# EAGLE design MaTouch ESP32-S3 Parallel TFT with Touch 7“ V1.2 (EAGLE 6.1)
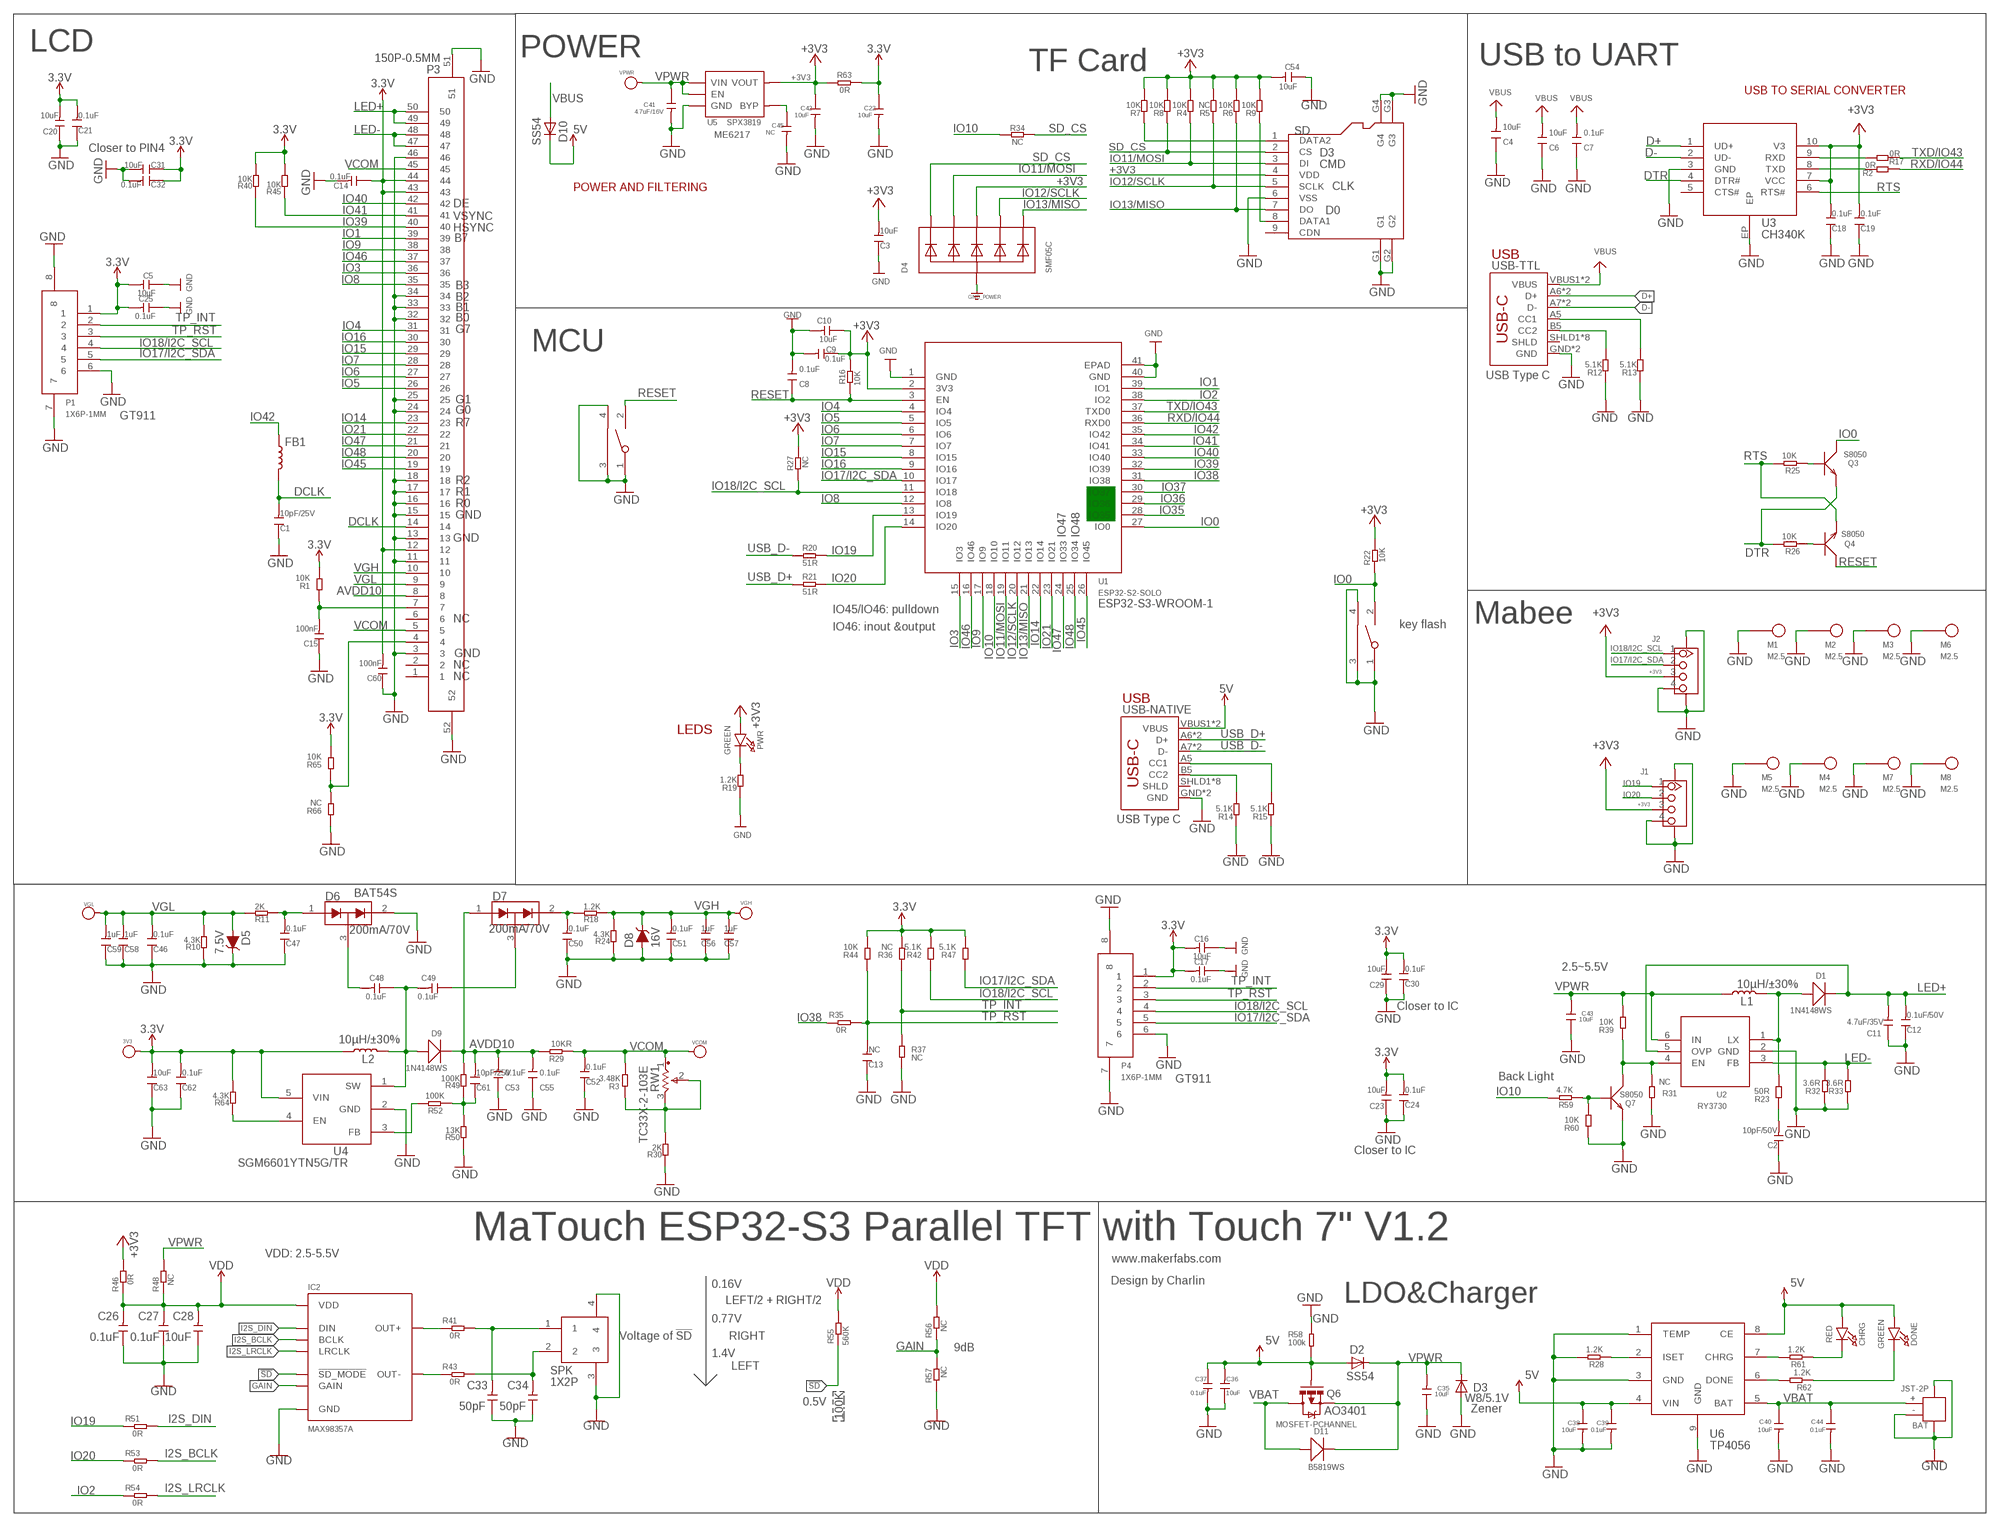
[diagram p0: schematic, sheet 1]

## Parts
3V3  PAD-TEST-POINT-CIRCLE'4545'  [TP_4545]
BAT  JST-2P  JST-2P-SMD'2.0'  [HW2-SMD-2.0-90D]
BOOT  TS24CA  [2*4*3.5MM]
C1  10pF/25V  DISCRETE_C-0603  [DISCRETE_C0603]
C2  10pF/50V  DISCRETE_C-0603  [DISCRETE_C0603]
C3  10uF  DISCRETE_C-0603  [DISCRETE_C0603]
C4  10uF  DISCRETE_C-0603  [DISCRETE_C0603]
C5  10uF  DISCRETE_C-0603  [DISCRETE_C0603]
C6  10uF  DISCRETE_C-0603  [DISCRETE_C0603]
C7  0.1uF  DISCRETE_C-0603  [DISCRETE_C0603]
C8  0.1uF  DISCRETE_C-0603  [DISCRETE_C0603]
C9  0.1uF  DISCRETE_C-0603  [DISCRETE_C0603]
C10  10uF  DISCRETE_C-0603  [DISCRETE_C0603]
C11  4.7uF/35V  DISCRETE_C-1206  [DISCRETE_C1206]
C12  0.1uF/50V  DISCRETE_C-0603  [DISCRETE_C0603]
C13  NC  DISCRETE_C-0603  [DISCRETE_C0603]
C14  0.1uF  DISCRETE_C-0603  [DISCRETE_C0603]
C15  100nF  DISCRETE_C-0603  [DISCRETE_C0603]
C16  10uF  DISCRETE_C-0603  [DISCRETE_C0603]
C17  0.1uF  DISCRETE_C-0603  [DISCRETE_C0603]
C18  0.1uF  DISCRETE_C-0603  [DISCRETE_C0603]
C19  0.1uF  DISCRETE_C-0603  [DISCRETE_C0603]
C20  10uF  DISCRETE_C-0603  [DISCRETE_C0603]
C21  0.1uF  DISCRETE_C-0603  [DISCRETE_C0603]
C22  10uF  C-0603  [0603]
C23  10uF  DISCRETE_C-0603  [DISCRETE_C0603]
C24  0.1uF  DISCRETE_C-0603  [DISCRETE_C0603]
C25  0.1uF  DISCRETE_C-0603  [DISCRETE_C0603]
C26  0.1uF  C-0603  [0603]
C27  0.1uF  C-0603  [0603]
C28  10uF  C-0603  [0603]
C29  10uF  DISCRETE_C-0603  [DISCRETE_C0603]
C30  0.1uF  DISCRETE_C-0603  [DISCRETE_C0603]
C31  10uF  DISCRETE_C-0603  [DISCRETE_C0603]
C32  0.1uF  DISCRETE_C-0603  [DISCRETE_C0603]
C33  50pF  C-0603  [0603]
C34  50pF  C-0603  [0603]
C35  10uF  C-0603  [0603]
C36  10uF  C-0603  [0603]
C37  0.1uF  C-0603  [0603]
C38  10uF  C-0603  [0603]
C39  0.1uF  C-0603  [0603]
C40  10uF  C-0603  [0603]
C41  4.7uF/16V  C-0603  [0603]
C42  10uF  C-0603  [0603]
C43  10uF  C-0603  [0603]
C44  0.1uF  C-0603  [0603]
C45  NC  C-0603  [0603]
C46  0.1uF  DISCRETE_C-0603  [DISCRETE_C0603]
C47  0.1uF  DISCRETE_C-0603  [DISCRETE_C0603]
C48  0.1uF  DISCRETE_C-0603  [DISCRETE_C0603]
C49  0.1uF  DISCRETE_C-0603  [DISCRETE_C0603]
C50  0.1uF  DISCRETE_C-0603  [DISCRETE_C0603]
C51  0.1uF  DISCRETE_C-0603  [DISCRETE_C0603]
C52  0.1uF  DISCRETE_C-0603  [DISCRETE_C0603]
C53  0.1uF  DISCRETE_C-0603  [DISCRETE_C0603]
C54  10uF  DISCRETE_C-0603  [DISCRETE_C0603]
C55  0.1uF  DISCRETE_C-0603  [DISCRETE_C0603]
C56  1uF  DISCRETE_C-0603  [DISCRETE_C0603]
C57  1uF  DISCRETE_C-0603  [DISCRETE_C0603]
C58  1uF  DISCRETE_C-0603  [DISCRETE_C0603]
C59  1uF  DISCRETE_C-0603  [DISCRETE_C0603]
C60  100nF  DISCRETE_C-0603  [DISCRETE_C0603]
C61  10pF/25V  DISCRETE_C-0603  [DISCRETE_C0603]
C62  0.1uF  DISCRETE_C-0603  [DISCRETE_C0603]
C63  10uF  DISCRETE_C-0603  [DISCRETE_C0603]
CHRG  RED  LED0805_NOOUTLINE  [CHIPLED_0805_NOOUTLINE]
D1  1N4148WS  D'0805'  [SOD323]
D2  SS54  DIODE-DO-214AC  [DO-214AC]
D3  W8/5.1V  DIODE-SOD123  [SOD123]
D4  SMF05C  TVSARRAY_5LANE  [SOT363]
D5  7.5V  DIODE-ZENER-MMSZ5232BS  [SOD-323]
D6  200mA/70V  BAV99  [SOT23-3]
D7  200mA/70V  BAV99  [SOT23-3]
D8  16V  DIODE-ZENER-MMSZ5232BS  [SOD-323]
D9  1N4148WS  D'0805'  [SOD323]
D10  SS54  DIODE-DO-214AC  [DO-214AC]
D11  B5819WS  D'0805'  [SOD323]
DONE  GREEN  LED0805_NOOUTLINE  [CHIPLED_0805_NOOUTLINE]
FB1  INDUCTORFB-30OHM  [0603]
IC2  MAX98357A  [TQFN-16]
J1  GROVE-CONNECTOR-SMD'90D'  [HW4-SMD-2.0-90D]
J2  GROVE-CONNECTOR-SMD'90D'  [HW4-SMD-2.0-90D]
L1  10µH/±30%  INDUCTOR-CR54-3.3UH  [CR54]
L2  10µH/±30%  INDUCTOR-CR54-3.3UH  [CR54]
M1  M2.5  [M2.5]
M2  M2.5  [M2.5]
M3  M2.5  [M2.5]
M4  M2.5  [M2.5]
M5  M2.5  [M2.5]
M6  M2.5  [M2.5]
M7  M2.5  [M2.5]
M8  M2.5  [M2.5]
P1  1X6P-1MM  [1*6P-SMT1MM]
P3  150P-0.5MM  [1*50P-SMT0.5MM]
P4  1X6P-1MM  [1*6P-SMT1MM]
PWR  GREEN  LED0805_NOOUTLINE  [CHIPLED_0805_NOOUTLINE]
Q3  S8050  TRANSISTOR-NPN-SOT23  [SOT23]
Q4  S8050  TRANSISTOR-NPN-SOT23  [SOT23]
Q6  MOSFET-PCHANNEL  [SOT23-3]
Q7  S8050  TRANSISTOR-NPN-SOT23  [SOT23]
R1  10K  DISCRETE_R-0603  [DISCRETE_R0603]
R2  0R  R-0603  [R0603]
R3  3.48K  DISCRETE_R-0603  [DISCRETE_R0603]
R4  10K  DISCRETE_R-0603  [DISCRETE_R0603]
R5  NC  DISCRETE_R-0603  [DISCRETE_R0603]
R6  10K  DISCRETE_R-0603  [DISCRETE_R0603]
R7  10K  DISCRETE_R-0603  [DISCRETE_R0603]
R8  10K  DISCRETE_R-0603  [DISCRETE_R0603]
R9  10K  DISCRETE_R-0603  [DISCRETE_R0603]
R10  4.3K  DISCRETE_R-0603  [DISCRETE_R0603]
R11  2K  DISCRETE_R-0603  [DISCRETE_R0603]
R12  5.1K  DISCRETE_R-0603  [DISCRETE_R0603]
R13  5.1K  DISCRETE_R-0603  [DISCRETE_R0603]
R14  5.1K  DISCRETE_R-0603  [DISCRETE_R0603]
R15  5.1K  DISCRETE_R-0603  [DISCRETE_R0603]
R16  10K  R-0603  [R0603]
R17  0R  R-0603  [R0603]
R18  1.2K  DISCRETE_R-0603  [DISCRETE_R0603]
R19  1.2K  DISCRETE_R-0603  [DISCRETE_R0603]
R20  51R  R-0603  [R0603]
R21  51R  R-0603  [R0603]
R22  10K  R-0603  [R0603]
R23  50R  DISCRETE_R-0603  [DISCRETE_R0603]
R24  4.3K  DISCRETE_R-0603  [DISCRETE_R0603]
R25  10K  R-0603  [R0603]
R26  10K  R-0603  [R0603]
R27  NC  R-0603  [R0603]
R28  1.2K  R-0603  [R0603]
R29  10KR  DISCRETE_R-0603  [DISCRETE_R0603]
R30  2K  DISCRETE_R-0603  [DISCRETE_R0603]
R31  NC  DISCRETE_R-0603  [DISCRETE_R0603]
R32  3.6R  DISCRETE_R-0603  [DISCRETE_R0603]
R33  3.6R  DISCRETE_R-0603  [DISCRETE_R0603]
R34  NC  R-0603  [R0603]
R35  0R  R-0603  [R0603]
R36  NC  DISCRETE_R-0603  [DISCRETE_R0603]
R37  NC  DISCRETE_R-0603  [DISCRETE_R0603]
R39  10K  DISCRETE_R-0603  [DISCRETE_R0603]
R40  10K  DISCRETE_R-0603  [DISCRETE_R0603]
R41  0R  R-0603  [R0603]
R42  5.1K  DISCRETE_R-0603  [DISCRETE_R0603]
R43  0R  R-0603  [R0603]
R44  10K  DISCRETE_R-0603  [DISCRETE_R0603]
R45  10K  DISCRETE_R-0603  [DISCRETE_R0603]
R46  0R  R-0603  [R0603]
R47  5.1K  DISCRETE_R-0603  [DISCRETE_R0603]
R48  NC  R-0603  [R0603]
R49  100K  DISCRETE_R-0603  [DISCRETE_R0603]
R50  13K  DISCRETE_R-0603  [DISCRETE_R0603]
R51  0R  R-0603  [R0603]
R52  100K  DISCRETE_R-0603  [DISCRETE_R0603]
R53  0R  R-0603  [R0603]
R54  0R  R-0603  [R0603]
R55  560K  R-0603  [R0603]
R56  NC  R-0603  [R0603]
R57  NC  R-0603  [R0603]
R58  100k  R-0603  [R0603]
R59  4.7K  DISCRETE_R-0603  [DISCRETE_R0603]
R60  10K  DISCRETE_R-0603  [DISCRETE_R0603]
R61  1.2K  R-0603  [R0603]
R62  1.2K  R-0603  [R0603]
R63  0R  R-0603  [R0603]
R64  4.3K  DISCRETE_R-0603  [DISCRETE_R0603]
R65  10K  DISCRETE_R-0603  [DISCRETE_R0603]
R66  NC  DISCRETE_R-0603  [DISCRETE_R0603]
RST  TS24CA  [2*4*3.5MM]
RW1  TC33X-2-103E  [TC33-3MM-SMD]
SD  HOLDER-MICROSD-9P  [9P-SMD-W/-RING]
SPK  1X2P  [1X2P-SMT1.25MM]
U1  ESP32­S2­SOLO  [ESP32-­S2-­SOLO]
U2  RY3730  [SOT23-6]
U3  CH340K  [ESOP-10-EP-150MIL]
U4  SGM6601YTN5G/TR  [SOT-23-5]
U5  SPX3819  [SOT23-5]
U6  TP4056  [SOP8-1.27P]
USB-NATIVE  USB_C5  [USB-C-16P-5]
USB-TTL  USB_C5  [USB-C-16P-5]
VCOM  PAD-TEST-POINT-CIRCLE'4545'  [TP_4545]
VGH  PAD-TEST-POINT-CIRCLE'4545'  [TP_4545]
VGL  PAD-TEST-POINT-CIRCLE'4545'  [TP_4545]
VPWR  PAD-TEST-POINT-CIRCLE'4545'  [TP_4545]

## Nets
3.3V: 3V3.T C5.2 C14.1 C16.2 C17.2 C20.2 C21.2 C22.1 C23.2 C24.2 C25.2 C29.2 C30.2 C31.1 C32.1 C60.2 C62.2 C63.2 L2.P$1 P1.1 P3.12 P3.43 P3.44 P4.1 R1.2 R36.2 R40.2 R42.2 R44.2 R45.2 R47.2 R63.2 R64.2 R65.2 U4.5(VIN)
5V: C36.2 C37.1 C38.1 C39.1 CHRG.A D2.A D10.C DONE.A Q6.1(G) R58.1 U6.4(VIN) U6.8(CE) USB-NATIVE.VBUS1(VBUS) USB-NATIVE.VBUS2(VBUS)
!SD: IC2.P$4(!SD_MODE) R55.1
+3V3: C3.2 C9.1 C10.1 C18.2 C19.2 C42.1 C54.2 D4.4(C3) J1.3 J2.3 PWR.A R4.2 R5.2 R6.2 R7.2 R8.2 R9.2 R16.2 R22.2 R27.2 R46.2 R63.1 SD.4(VDD) U1.2(3V3) U3.7(VCC) U3.10(V3) U5.5(VOUT)
AVDD10: C53.2 C55.2 C61.2 D7.1(A1) D9.- P3.8 R29.2 R49.2
D+: U3.1(UD+) USB-TTL.A6(D+) USB-TTL.B6(D+)
D-: U3.2(UD-) USB-TTL.A7(D-) USB-TTL.B7(D-)
DCLK: C1.2 FB1.2 P3.14
DTR: Q3.2(E) R26.2 U3.4(DTR#)
GAIN: IC2.P$2(GAIN) R56.1 R57.2
GND: BAT.3 BAT.4 BAT.- BOOT.1 BOOT.3 BOOT.4 C1.1 C2.1 C3.1 C4.1 C5.1 C6.1 C7.1 C8.2 C9.2 C10.2 C11.1 C12.1 C13.1 C14.2 C15.1 C16.1 C17.1 C18.1 C19.1 C20.1 C21.1 C22.2 C23.1 C24.1 C25.1 C26.1 C27.1 C28.1 C29.1 C30.1 C31.2 C32.2 C33.1 C34.1 C35.1 C36.1 C37.2 C38.2 C39.2 C40.2 C41.2 C42.2 C43.1 C44.2 C45.2 C46.1 C47.1 C50.1 C51.1 C52.1 C53.1 C54.1 C55.1 C56.1 C57.1 C58.1 C59.1 C60.1 C62.1 C63.1 D3.A D4.2(A) D5.C D6.2(C2) D8.A IC2.P$3(GND) IC2.P$11(GND) IC2.P$15(GND) IC2.P$EP(GND) J1.4 J1.SS1 J1.SS2 J2.4 J2.SS1 J2.SS2 M1.1 M2.1 M3.1 M4.1 M5.1 M6.1 M7.1 M8.1 P1.6 P1.7 P1.8 P3.3 P3.11 P3.13 P3.15 P3.16 P3.17 P3.18 P3.24 P3.25 P3.32 P3.33 P3.34 P3.46 P3.51 P3.52 P4.6 P4.7 P4.8 Q7.2(E) R10.1 R12.1 R13.1 R14.1 R15.1 R19.1 R24.1 R28.2 R30.1 R31.1 R32.1 R33.1 R37.2 R50.1 R57.1 R58.2 R60.1 R66.1 RST.1 RST.3 RST.4 SD.6(VSS) SD.G1 SD.G2 SD.G3 SD.G4 SPK.3 SPK.4 U1.1(GND) U1.40(GND) U1.41(EPAD) U2.2(GND) U3.3(GND) U3.EP U4.2(GND) U5.2(GND) U6.1(TEMP) U6.3(GND) U6.9(GND) USB-NATIVE.GND USB-NATIVE.GND2(GND) USB-TTL.GND USB-TTL.GND2(GND) ; supply symbol labelled GND_POWER
I2S_BCLK: IC2.P$16(BCLK) R53.2
I2S_DIN: IC2.P$1(DIN) R51.2
I2S_LRCLK: IC2.P$14(LRCLK) R54.2
IO0: BOOT.2 Q3.3(C) R22.1 U1.27(IO0)
IO1: P3.39 U1.39(IO1)
IO2: R54.1 U1.38(IO2)
IO3: P3.36 U1.15(IO3)
IO4: P3.31 U1.4(IO4)
IO5: P3.26 U1.5(IO5)
IO6: P3.27 U1.6(IO6)
IO7: P3.28 U1.7(IO7)
IO8: P3.35 U1.12(IO8)
IO9: P3.38 U1.17(IO9)
IO10: R34.1 R59.2 U1.18(IO10)
IO11/MOSI: D4.3(C2) R4.1 SD.3(DI) U1.19(IO11)
IO12/SCLK: D4.5(C4) R5.1 SD.5(SCLK) U1.20(IO12)
IO13/MISO: D4.6(C5) R6.1 SD.7(DO) U1.21(IO13)
IO14: P3.23 U1.22(IO14)
IO15: P3.29 U1.8(IO15)
IO16: P3.30 U1.9(IO16)
IO17/I2C_SDA: J2.2 P1.5 P4.5 R47.1 U1.10(IO17)
IO18/I2C_SCL: J2.1 P1.4 P4.4 R27.1 R42.1 U1.11(IO18)
IO19: J1.1 R20.2 R51.1 U1.13(IO19)
IO20: J1.2 R21.2 R53.1 U1.14(IO20)
IO21: P3.22 U1.23(IO21)
IO35: U1.28(IO35)
IO36: U1.29(IO36)
IO37: U1.30(IO37)
IO38: R35.1 U1.31(IO38)
IO39: P3.40 R40.1 U1.32(IO39)
IO40: P3.42 U1.33(IO40)
IO41: P3.41 R45.1 U1.34(IO41)
IO42: FB1.1 U1.35(IO42)
IO45: P3.19 U1.26(IO45)
IO46: P3.37 U1.16(IO46)
IO47: P3.21 U1.24(IO33)
IO48: P3.20 U1.25(IO34)
LCD_RST: C15.2 P3.7 R1.1
LED+: C11.2 C12.2 D1.- P3.49 P3.50 U2.5(OVP)
LED-: P3.47 P3.48 R32.2 R33.2 U2.3(FB)
N$1: C47.2 D6.1(A1) R11.1
N$2: Q4.1(B) R26.1
N$3: Q3.1(B) R25.1
N$4: C61.1 R49.1 R50.2 R52.1
N$5: P3.4 R65.1 R66.2
N$6: R15.2 USB-NATIVE.A5(CC1)
N$7: PWR.C R19.2
N$8: C48.2 D6.3(COM)
N$9: C48.1 C49.2 D9.+ L2.P$2 U4.1(SW)
N$10: R13.2 USB-TTL.A5(CC1)
N$11: R12.2 USB-TTL.B5(CC2)
N$12: C49.1 D7.3(COM)
N$13: C50.2 D7.2(C2) R18.2
N$14: R14.2 USB-NATIVE.B5(CC2)
N$15: R52.2 U4.3(FB)
N$16: R3.1 R30.2 RW1.2 RW1.3
N$17: D1.+ L1.P$2 R23.2 U2.1(LX)
N$19: R64.1 U4.4(EN)
N$21: IC2.P$9(OUT+) R41.1
N$22: C2.2 R23.1
N$23: IC2.P$10(OUT-) R43.1
N$24: Q7.3(C) R31.2 R39.1 U2.4(EN)
N$26: C33.2 R41.2 SPK.1
N$27: C34.2 R43.2 SPK.2
N$29: Q7.1(B) R59.1 R60.2
N$30: R28.1 U6.2(ISET)
N$31: R61.2 U6.7(CHRG)
N$32: R62.2 U6.6(DONE)
N$33: CHRG.C R61.1
N$34: DONE.C R62.1
N$46: R17.2 U3.9(RXD)
N$47: R7.1 SD.1(DATA2)
N$48: R9.1 SD.8(DATA1)
N$49: R2.2 U3.8(TXD)
N$76: C45.1 U5.4(BYP)
RESET: C8.1 Q4.3(C) R16.1 RST.2 U1.3(EN)
RTS: Q4.2(E) R25.2 U3.6(RTS#)
RXD/IO44: R2.1 U1.36(RXD0)
SD_CS: D4.1(C1) R8.1 R34.2 SD.2(CS)
TP_INT: P1.2 P4.2 R36.1 R37.1
TP_RST: C13.2 P1.3 P4.3 R35.2 R44.1
TXD/IO43: R17.1 U1.37(TXD0)
USB_D+: R21.1 USB-NATIVE.A6(D+) USB-NATIVE.B6(D+)
USB_D-: R20.1 USB-NATIVE.A7(D-) USB-NATIVE.B7(D-)
VBAT: BAT.+ C40.1 C44.1 D11.+ Q6.3(D) U6.5(BAT)
VBUS: C4.2 C6.2 C7.2 D10.A USB-TTL.VBUS1(VBUS) USB-TTL.VBUS2(VBUS)
VCOM: C52.2 P3.5 P3.45 R3.2 R29.1 RW1.1 VCOM.T
VDD: C26.2 C27.2 C28.2 IC2.P$7(VDD) IC2.P$8(VDD) R46.1 R48.1 R55.2 R56.2
VGH: C51.2 C56.2 C57.2 D8.C P3.10 R18.1 R24.2 VGH.T
VGL: C46.2 C58.2 C59.2 D5.A P3.9 R10.2 R11.2 VGL.T
VPWR: C35.2 C41.1 C43.2 D2.C D3.C D11.- L1.P$1 Q6.2(S) R39.2 R48.2 U2.6(IN) U5.1(VIN) U5.3(EN) VPWR.T
Unconnected: P3.1 P3.2 P3.6 SD.9(CDN) U3.5(CTS#) USB-NATIVE.SHLD1(SHLD) USB-NATIVE.SHLD2(SHLD) USB-NATIVE.SHLD3(SHLD) USB-NATIVE.SHLD4(SHLD) USB-NATIVE.SHLD5(SHLD) USB-NATIVE.SHLD6(SHLD) USB-NATIVE.SHLD7(SHLD) USB-NATIVE.SHLD8(SHLD) USB-TTL.SHLD1(SHLD) USB-TTL.SHLD2(SHLD) USB-TTL.SHLD3(SHLD) USB-TTL.SHLD4(SHLD) USB-TTL.SHLD5(SHLD) USB-TTL.SHLD6(SHLD) USB-TTL.SHLD7(SHLD) USB-TTL.SHLD8(SHLD)

## Notes on the sheet
- LCD | POWER
- TF Card | USB to UART
- USB TO SERIAL CONVERTER
- ME6217
- Closer to PIN4
- D3
- CMD
- POWER AND FILTERING | CLK
- DE
- D0
- VSYNC
- HSYNC
- B7
- USB
- B3
- B2
- B1
- B0
- G7
- MCU
- USB Type C
- G1
- G0
- GT911
- R7
- R2
- R1
- R0
- GND
- IO47 | IO48
- GND
- ESP32-S3-WROOM-1
- IO45/IO46: pulldown
- NC | Mabee
- IO46: inout &output | key flash
- GND
- NC
- NC
- USB
- LEDS
- USB Type C
- BAT54S
- 2.5~5.5V
- Closer to IC
- GT911 | Back Light
- Closer to IC
- MaTouch ESP32-S3 Parallel TFT with Touch 7" V1.2
- VDD: 2.5-5.5V
- www.makerfabs.com
- Design by Charlin
- 0.16V
- LEFT/2 + RIGHT/2 | LDO&Charger
- 0.77V
- Voltage of !SD | RIGHT
- 9dB
- 1.4V
- LEFT
- 0.5V
- AO3401 | Zener
- 100K

## Library data of the parts
3V3 VCOM VGH VGL VPWR = Discrete:PAD-TEST-POINT-CIRCLE; PARTNO: DNP
BAT = Connector-new:JST-2P-SMD: 2P-SMD-1.0-90D:320110054;2P-SMD-2.0-90D:320110026
BOOT RST = sale:TS24CA
C1-C21 C23-C25 C29-C32 C46-C63 = A9G:DISCRETE_C*: Ceramic Capacitors
C22 C26-C28 C33-C45 = Discrete:C*: Ceramic Capacitors
CHRG DONE PWR = microbuilder:LED: LED 0603 - 0603 Surface Mount Package 2mA: Green LED - Low Power (3.9mcd, 2ma, 1.7Vf) - Digikey: 475-2709-2-ND Orange LED - Low Power (9.8mcd, 2ma, 1.8Vf) - Digikey: 475-1194-2-ND Red LED - Low Power (5mcd, 2ma, 1.8Vf) - Digikey: 475-1195-2-ND Yellow LED - Low Power (7mcd, 2ma, 1.8Vf) - Digikey: 475-1196-2-ND 5mA: Blue LED - Low Power (17mcd, 5ma, 2.9Vf) - Digikey: LNJ937W8CRACT-ND 0805 - 0805 Surface Mount Package 2mA: Red LED (8.8mcd, 2mA, 1.8Vf, Clear) - Low Power [Digikey: 475-2510-1-ND] Green LED (5mcd, 2mA, 1.8Vf, Clear) - Low Power [Digikey: 475-2730-1-ND] Yellow LED (11.3mcd, 2mA, 1.8Vf, Clear) - Low Power [Digikey: 475-2555-1-ND] 20mA: Red LED (104mcd, 20mA, Diffused) - LS R976 [Digikey: 475-1278-6-ND] Red LED (12mcd, 20mA, 2.0Vf, Clear) - APT2012EC [Digikey: 754-1128-1-ND] Green LED (15mcd, 20mA, 2.2Vf, Clear) - APT2012GC [Digikey: 754-1131-1-ND] Orange LED (160mcd, 20mA, 2.1Vf, Clear) - APT2012SECK [Digikey: 754-1130-1-ND] 1206 - 1206 Surface Mount Package Green LED (26mcd, 20mA, Diffused) - LG N971 [Digikey: 475-1407-6-ND] Red LED (15mcd, 20mA, Diffused) - LH N974 [Digikey: 475-1416-6-ND] Cree - Cree High-Power Surface Mount LEDs XPEBWT-L1-0000-00D50 - White 111lm 350mA 2.9Vf 6200K 110° XTEAWT-00-0000-00000LEE3 - White 114lm 350mA 2.85Vf 5000K 115° Everlight - Everlight 45-21 Series Surface Mount LEDs 45-21/QK2C-B2832AC2CB2/2T - Warm White 2000mcd 20mA 3.25Vf 3050K 120° 45-21/LK2C-B38452C4CB2/2T - Nuetral White 2000mcd 20mA 3.25Vf 4150K 120° 45-21/LK2C-B50634C6CB2/2T - Cold White 2200mcd 20mA 3.25Vf 5650K 120° PLCC2 Reverse Mount LS T77K-J1L2-1-0-2-R18-Z - Red 11.25mcd 2mA 1.8Vf 630nm 120° LO T77K-L1M2-24-Z - Orange 19.6mcd 2mA 1.8Vf 606nm 120° LY T77K-K2M1-26-Z - Yellow 15.7mcd 2mA 1.8Vf 587nm 120°
D1 D9 D11 = Discrete:D*
D2 D3 D10 = diode:DIODE-: DIODE
D4 = microbuilder:TVSARRAY_5LANE: Voltage Transient Suppressor Array SOT363 SMF05C - 100W 5V: Digikey - SMF05CT1GOSCT-ND
D5 D8 = SparkFun-DiscreteSemi:DIODE-ZENER: Zener Diode A Zener diode allows current to flow from its anode to its cathode like a normal semiconductor diode, but it also permits current to flow in the reverse direction when its "Zener voltage" is reached. - WIkipedia; PROD_ID: DIO-12442; VALUE: 5.6V
D6 D7 = SparkFun-DiscreteSemi:BAV99: Series-pair diode array Two small signal silicon diodes connected anode to cathode. Connections to all three nodes available. Link to datasheet <https://www.fairchildsemi.com/datasheets/BA/BAV99.pdf> SparkFun Products: SparkFun AutoDriver <https://www.sparkfun.com/products/13752>; PROD_ID: DIO-10647
FB1 = SparkFun-Coils:INDUCTOR: Inductors Resist changes in electrical current. Basically a coil of wire. SparkFun Products: SparkFun Load Cell Amplifier - HX711 <https://www.sparkfun.com/products/13879> IOIO-OTG - V2.2 <https://www.sparkfun.com/products/13613>; PROD_ID: NDUC-07859
IC2 = SparkFun-IC-Amplifiers:MAX98357A: I2S DAC 3.2W (4-8ohm); PROD_ID: IC-14032
J1 J2 = Connector-new:GROVE-CONNECTOR-SMD: 4P-SMD-2.0:320110030;4P-SMD-2.0-90D:320110032
L1 L2 = SparkFun-Coils:INDUCTOR: Inductors Resist changes in electrical current. Basically a coil of wire. SparkFun Products: SparkFun Load Cell Amplifier - HX711 <https://www.sparkfun.com/products/13879> IOIO-OTG - V2.2 <https://www.sparkfun.com/products/13613>; PROD_ID: NDUC-11157; VALUE: 3.3µH/±30%/3.4A
M1-M8 = sale:M2.5
P1 P4 = sale:1X6P-1MM
P3 = sale:1*50P-0.5MM
Q3 Q4 Q7 = Discrete:TRANSISTOR-NPN*: NPN audion
Q6 = User-Submitted:MOSFET-PCHANNEL: Generic PMOSFET IRLML2244 - TRANS-11153 (SOT-23 -20V -4.3A) (1.Gate 2.Source 3.Drain) FQP27P06 - COM-10349 <http://www.sparkfun.com/products/10349> (TO-220 -60V -27A) (1.Gate 2.Source 3.Drain); PROD_ID: TRANS-08285
R1 R3-R15 R18 R19 R23 R24 R29-R33 R36 R37 R39 R40 R42 R44 R45 R47 R49 R50 R52 R59 R60 R64-R66 = A9G:DISCRETE_R*
R2 R16 R17 R20-R22 R25-R28 R34 R35 R41 R43 R46 R48 R51 R53-R58 R61-R63 = Discrete:R*
RW1 = sale:TC33X-2-103E
SD = Connector:HOLDER-MICROSD-9P
SPK = sale:1X2P
U1 = self:ESP32­S2­SOLO
U2 = sale:RY3730
U3 = sale:CH340K
U4 = sale:SGM6601YTN5G/TR
U5 = IC:SPX3819
U6 = self:TP4056
USB-NATIVE USB-TTL = USBC:USB_C: USB Type C 16Pin Connector Super Speed pins not available on the 16-pin purely SMD connector so this part is best for USB 2.0 implementations. D1 and D2 are tied together enabling D+/- no matter which way the cable is plugged into the connector. The two channel configuration pins (CC1/2) are exposed. These are normally connected to ground via 5.1k resistors but can be reconfigured for high current/high power applications.

## Net classes
0 default: width 0.203 mm
1 vbat: width 0.254 mm, drill 0.305 mm, clearance 0.152 mm

## Board
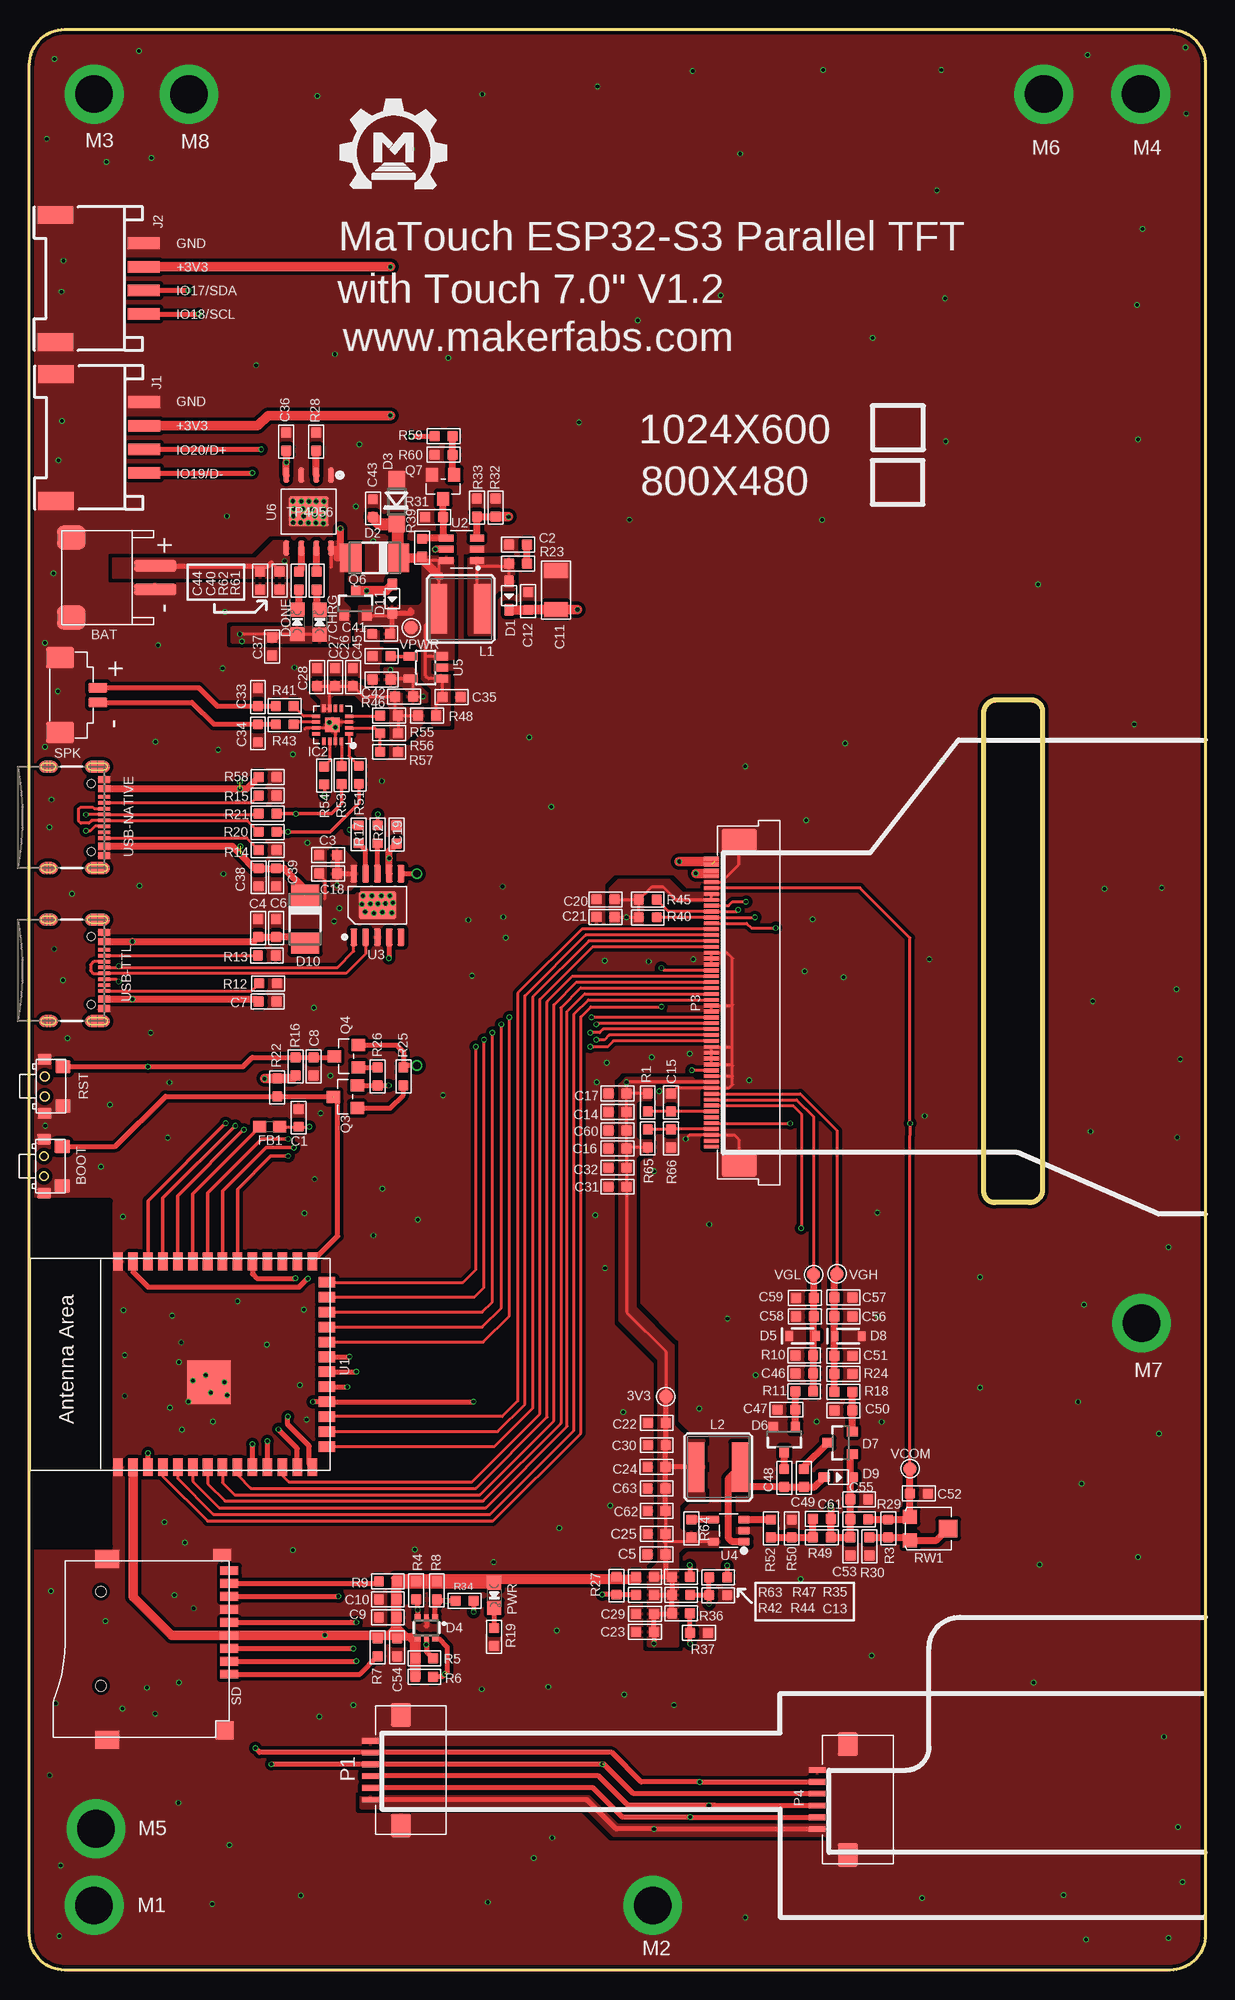
[diagram p1: board, top side]
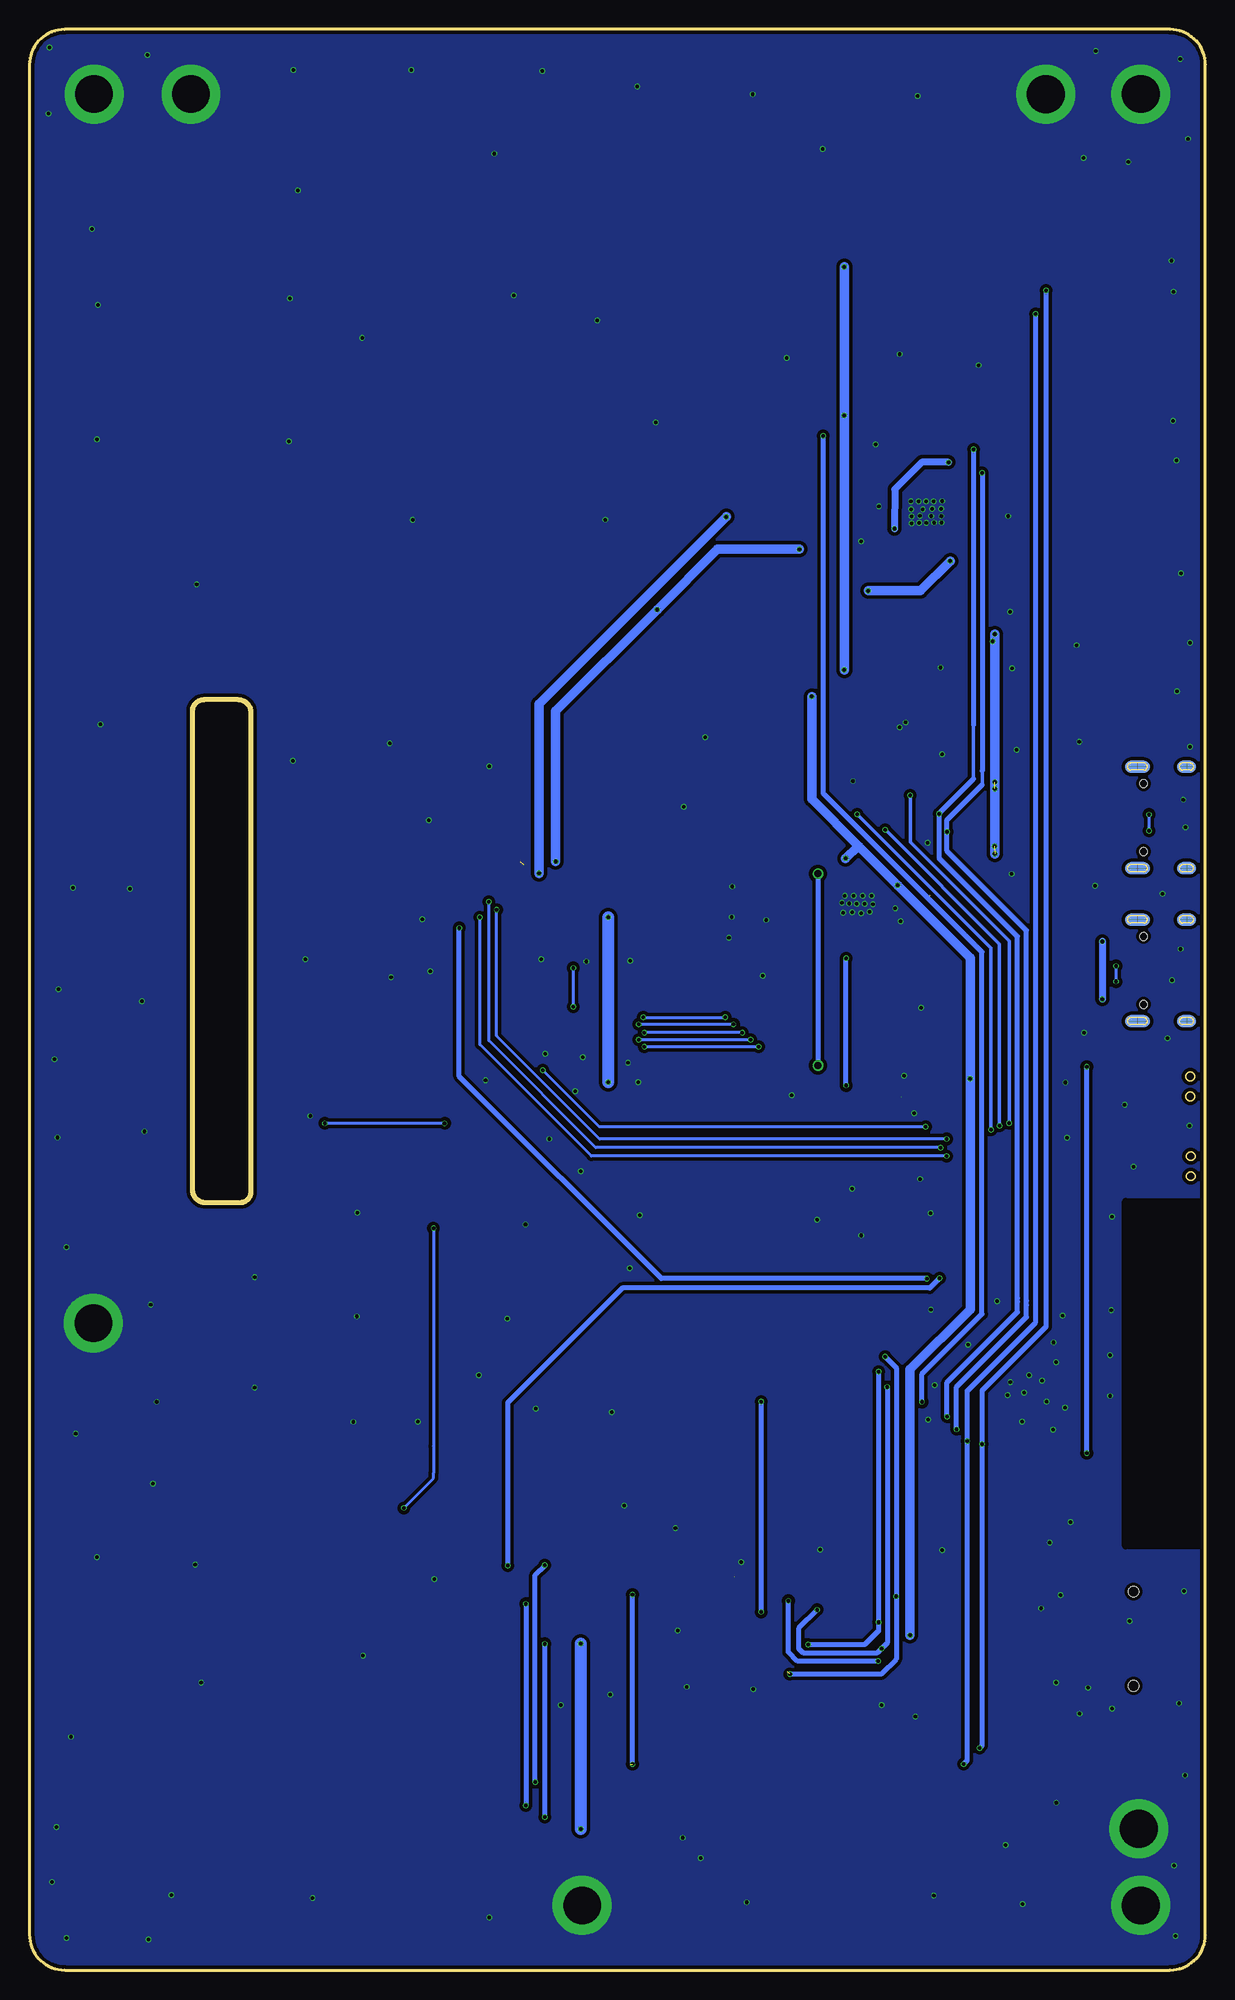
[diagram p2: board, bottom side, seen from below]

Size 100 x 165 mm. Coordinates in mm from the lower left corner, seen from the top.
Outline: 100,162 100,3 arc-90 97,0 3,0 arc-90 0,3 0,162 arc-90 3,165 97,165 arc-90 100,162
Outline: 85.03,65.25 82.09,65.25 arc-90 81.15,66.19 81.15,106.91 arc-90 82.25,108 85.17,108 arc-90 86.15,107.01 86.15,66.38 arc-90 85.03,65.25
Copper layers (1*16): Top 0.035mm / dielectric 1.5mm / Bottom 0.035mm
Design rules: minimum track width 6mil, minimum drill 10mil, track to track 6mil, track to pad 6mil, pad to pad 6mil, via to via 6mil, smd to smd 0mil, copper to edge 10mil, drill to drill 10mil, minimum pad ring 3mil, minimum via ring 3mil, stop-mask expansion 2mil, vias tented up to drill 100mil, thermal gap 0mil
tRestrict: area 0,36.1 to 6.8,65.4
bRestrict: area 0,36.1 to 6.8,65.4

### Footprints (pad centres in the part's own frame; a part is rotated, then mirrored left to right if it is on the bottom)
TP_4545 = smd 1.143 x 1.143: T 0,0
HW2-SMD-2.0-90D = smd 2 x 2.4: 3 3.4,-2.181; 4 -3.4,-2.181 | smd 1 x 3.6: + -1,4.953; - 1,4.953
2*4*3.5MM = smd 1.15 x 1.3: 1 -1.675,0; 2 1.675,0 | smd 0.9 x 1.2: 3 2.3,1.55; 4 -2.3,1.55
DISCRETE_C0603 = smd 0.889 x 0.889: 1 -0.762,0; 2 0.762,0
DISCRETE_C1206 = smd 1.27 x 2.032: 1 -1.651,0; 2 1.651,0
0603 = smd 0.889 x 0.889: 1 -0.762,0; 2 0.762,0
CHIPLED_0805_NOOUTLINE = smd 1.2 x 1.2: A 0,-1.05; C 0,1.05
SOD323 = smd 1 x 0.8: + -1.2,0; - 1.2,0
DO-214AC = smd 1.8 x 2.4: A 2.025,0; C -2.025,0
SOD123 = smd 1.4 x 1.4: A 1.9,0; C -1.9,0
SOT363 = smd 0.5 x 0.5: 1 -0.75,-0.9; 3 0.75,-0.9; 4 0.75,0.9; 6 -0.75,0.9 | smd 0.4 x 0.5: 2 0,-0.9; 5 0,0.9
SOD-323 = smd 0.63 x 0.83: A 1.15,0; C -1.15,0
SOT23-3 = smd 0.8 x 0.9: 1 -0.95,-1; 2 0.95,-1; 3 0,1.1
0603' = smd 1.1 x 1: 1 -0.85,0; 2 0.85,0
TQFN-16 = smd 0.3 x 0.65: P$1 -0.75,-1.4; P$2 -0.25,-1.4; P$3 0.25,-1.4; P$4 0.75,-1.4; P$9 0.75,1.4; P$10 0.25,1.4; P$11 -0.25,1.4; P$12 -0.75,1.4 | smd 0.65 x 0.3: P$5 1.4,-0.75; P$6 1.4,-0.25; P$7 1.4,0.25; P$8 1.4,0.75; P$13 -1.4,0.75; P$14 -1.4,0.25; P$15 -1.4,-0.25; P$16 -1.4,-0.75 | smd 1.23 x 1.23: P$EP 0,0
HW4-SMD-2.0-90D = smd 1.01 x 2.74: 1 -3,-0.1; 2 -1,-0.1; 3 1,-0.1; 4 3,-0.1 | smd 1.5 x 3: SS1 -5.4,7.4; SS2 5.4,7.4
CR54 = smd 4.2 x 1.4: P$1 0,1.85; P$2 0,-1.85
M2.5 = drill 3.2 pad 5: 1 0,0
1*6P-SMT1MM = smd 0.5 x 1.5: 1 -2.5,0; 2 -1.5,0; 3 -0.5,0; 4 0.5,0; 5 1.5,0; 6 2.5,0 | smd 2 x 1.7: 7 4.7,-2.6; 8 -4.7,-2.6
1*50P-SMT0.5MM = smd 0.3 x 1.3: 1 -12.25,0; 2 -11.75,0; 3 -11.25,0; 4 -10.75,0; 5 -10.25,0; 6 -9.75,0; 7 -9.25,0; 8 -8.75,0; 9 -8.25,0; 10 -7.75,0; 11 -7.25,0; 12 -6.75,0; 13 -6.25,0; 14 -5.75,0; 15 -5.25,0; 16 -4.75,0; 17 -4.25,0; 18 -3.75,0; 19 -3.25,0; 20 -2.75,0; 21 -2.25,0; 22 -1.75,0; 23 -1.25,0; 24 -0.75,0; 25 -0.25,0; 26 0.25,0; 27 0.75,0; 28 1.25,0; 29 1.75,0; 30 2.25,0; 31 2.75,0; 32 3.25,0; 33 3.75,0; 34 4.25,0; 35 4.75,0; 36 5.25,0; 37 5.75,0; 38 6.25,0; 39 6.75,0; 40 7.25,0; 41 7.75,0; 42 8.25,0; 43 8.75,0; 44 9.25,0; 45 9.75,0; 46 10.25,0; 47 10.75,0; 48 11.25,0; 49 11.75,0; 50 12.25,0 | smd 2 x 3: 51 13.79,-2.35; 52 -13.79,-2.35
SOT23 = smd 1.016 x 1.143: 1 -0.95,-1.016; 2 0.95,-1.016; 3 0,1.016
DISCRETE_R0603 = smd 0.889 x 0.889: 1 -0.762,0; 2 0.762,0
R0603 = smd 0.889 x 0.889: 1 -0.762,0; 2 0.762,0
TC33-3MM-SMD = smd 1.2 x 1.2: 1 -1,-1.625; 2 1,-1.625 | smd 1.5 x 1.6: 3 0,1.625
9P-SMD-W/-RING = smd 1.524 x 0.762: 1 0,4.4; 2 0,3.3; 3 0,2.2; 4 0,1.1; 5 0,0; 6 0,-1.1; 7 0,-2.2; 8 0,-3.3; 9 0,-4.4 | smd 1.524 x 1.016: G1 0.6,-5.746 | smd 2.032 x 1.524: G2 10.373,-5.4; G3 10.373,10 | smd 1.524 x 1.524: G4 0.392,9.181 | hole 0.889: 10.9,-2.6; 10.9,5.4
1X2P-SMT1.25MM = smd 0.8 x 1.6: 1 -0.625,0; 2 0.625,0 | smd 1.8 x 2.4: 3 3.175,-3.2; 4 -3.175,-3.2
ESP32-­S2-­SOLO = smd 1.5 x 0.9: 1 -8.75,5.26; 2 -8.75,3.99; 3 -8.75,2.72; 4 -8.75,1.45; 5 -8.75,0.18; 6 -8.75,-1.09; 7 -8.75,-2.36; 8 -8.75,-3.63; 9 -8.75,-4.9; 10 -8.75,-6.17; 11 -8.75,-7.44; 12 -8.75,-8.71; 13 -8.75,-9.98; 14 -8.75,-11.25; 27 8.75,-11.25; 28 8.75,-9.98; 29 8.75,-8.71; 30 8.75,-7.44; 31 8.75,-6.17; 32 8.75,-4.9; 33 8.75,-3.63; 34 8.75,-2.36; 35 8.75,-1.09; 36 8.75,0.18; 37 8.75,1.45; 38 8.75,2.72; 39 8.75,3.99; 40 8.75,5.26 | smd 0.9 x 1.5: 15 -6.985,-12.5; 16 -5.715,-12.5; 17 -4.445,-12.5; 18 -3.175,-12.5; 19 -1.905,-12.5; 20 -0.635,-12.5; 21 0.635,-12.5; 22 1.905,-12.5; 23 3.175,-12.5; 24 4.445,-12.5; 25 5.715,-12.5; 26 6.985,-12.5 | smd 3.7 x 3.7: 41 -1.5,-2.46
SOT23-6 = smd 1.2 x 0.6: 1 -1.3,0.95; 2 -1.3,0; 3 -1.3,-0.95; 4 1.3,-0.95; 5 1.3,0; 6 1.3,0.95
ESOP-10-EP-150MIL = smd 1.5 x 0.6: 1 -2.7,2; 2 -2.7,1; 3 -2.7,0; 4 -2.7,-1; 5 -2.7,-2; 6 2.7,-2; 7 2.7,-1; 8 2.7,0; 9 2.7,1; 10 2.7,2 | smd 2.4 x 3.2: EP 0,0
SOT-23-5 = smd 0.7 x 1: 1 -0.95,-1.3; 2 0,-1.3; 3 0.95,-1.3; 4 0.95,1.3; 5 -0.95,1.3
SOT23-5 = smd 0.69 x 1.2: 1 -0.95,-1.3; 2 0,-1.3; 3 0.95,-1.3; 4 0.95,1.3; 5 -0.95,1.3
SOP8-1.27P = smd 1.27 x 0.51: 1 -3.1,1.905; 2 -3.1,0.635; 3 -3.1,-0.635; 4 -3.1,-1.905; 5 3.1,-1.905; 6 3.1,-0.635; 7 3.1,0.635; 8 3.1,1.905 | smd 2.5 x 3.4: 9 0,0
USB-C-16P-5 = smd 0.3 x 1: A5 -1.25,-0.34; A6 -0.25,-0.34; A7 0.25,-0.34; A8 1.25,-0.34; B5 1.75,-0.34; B6 0.75,-0.34; B7 -0.75,-0.34; B8 -1.75,-0.34 | smd 0.6 x 1: GND -3.225,-0.34; GND2 3.225,-0.34; VBUS1 -2.45,-0.34; VBUS2 2.45,-0.34 | smd 1 x 2.1: SHLD1 -4.32,-0.915; SHLD2 4.32,-0.915 | smd 1 x 2.1 bottom: SHLD3 -4.32,-0.915; SHLD4 4.32,-0.915 | smd 1 x 1.6: SHLD5 -4.32,-5.095; SHLD8 4.32,-5.095 | smd 1 x 1.6 bottom: SHLD6 -4.32,-5.095; SHLD7 4.32,-5.095 | hole 0.65: -2.89,-1.445; 2.89,-1.445

### Placement (x,y rotation side)
3V3  54.13,48.77 270 top
BAT  5.75,118.39 270 top
BOOT  2.79,68.35 90 top
C1  22.89,72.47 270 top
C2  41.55,121.18 0 top
C3  25.4,94.79 0 top
C4  19.46,88.6 270 top
C5  53.31,35.36 0 top
C6  20.98,88.6 270 top
C7  20.27,82.35 180 top
C8  24.18,76.83 270 top
C9  30.48,30 180 top
C10  30.48,31.52 180 top
C11  44.78,117.32 270 top
C12  42.42,116.41 270 top
C13  58.57,31.88 180 top
C14  50.01,72.95 180 top
C15  54.56,73.76 270 top
C16  50.01,69.85 0 top
C17  50.01,74.52 0 top
C18  25.4,93.22 0 top
C19  31.22,96.55 270 top
C20  48.99,91.04 0 top
C21  49,89.54 0 top
C22  53.35,46.52 180 top
C23  52.34,28.76 0 top
C24  53.34,42.77 0 top
C25  53.34,37.08 0 top
C26  27.51,109.93 270 top
C27  25.98,109.93 270 top
C28  24.46,109.93 270 top
C29  52.35,30.3 0 top
C30  53.35,44.63 0 top
C31  50.01,66.61 180 top
C32  50.01,68.22 180 top
C33  19.43,108.23 270 top
C34  19.43,105.16 90 top
C35  35.89,108.23 180 top
C36  21.84,129.95 270 top
C37  20.65,112.52 270 top
C38  19.51,92.91 270 top
C39  20.98,92.91 270 top
C40  21.29,118.14 270 top
C41  29.92,113.61 180 top
C42  29.95,109.73 180 top
C43  29.21,124.28 270 top
C44  19.63,118.14 270 top
C45  29.95,111.71 180 top
C46  65.89,50.72 0 top
C47  64.36,47.65 0 top
C48  64.19,41.83 90 top
C49  65.86,41.83 270 top
C50  69.22,47.57 0 top
C51  69.22,52.22 180 top
C52  75.64,40.51 180 top
C53  69.8,36.02 90 top
C54  31.27,27.43 90 top
C55  70.56,40.03 180 top
C56  69.22,55.58 180 top
C57  69.22,57.2 180 top
C58  65.94,55.58 0 top
C59  65.94,57.15 0 top
C60  50.01,71.37 0 top
C61  67.39,38.35 0 top
C62  53.34,39.04 0 top
C63  53.34,40.97 0 top
CHRG  24.69,114.6 0 top
D1  40.79,116.87 270 top
D2  29.36,120.07 180 top
D3  31.24,124.84 90 top
D4  33.76,29.1 180 top
D5  65.76,53.92 0 top
D6  64.19,45.16 180 top
D7  68.99,44.83 90 top
D8  69.62,53.9 0 top
D9  68.78,41.91 0 top
D10  23.44,89.36 270 top
D11  30.86,116.61 270 top
DONE  22.78,114.63 0 top
FB1  [0603']  20.45,71.7 0 top
IC2  25.78,105.87 90 top
J1  9.66,130.29 90 top
J2  9.61,143.81 90 top
L1  36.68,115.72 90 top
L2  58.57,42.77 90 top
M1  5.5,5.5 0 top
M2  53,5.5 0 top
M3  5.5,159.5 0 top
M4  94.5,159.5 0 top
M5  5.66,12.01 0 top
M6  86.26,159.5 0 top
M7  94.56,55 0 top
M8  13.56,159.49 0 top
P1  29,17 90 top
P3  58,82.25 90 top
P4  67,14.5 90 top
PWR  39.52,31.86 180 top
Q3  26.86,74.24 90 top
Q4  26.94,77.69 90 top
Q6  27.74,116.18 0 top
Q7  35.18,126.11 180 top
R1  52.58,73.76 90 top
R2  29.62,96.57 270 top
R3  73.03,37.54 90 top
R4  32.89,32.28 90 top
R5  33.58,26.49 180 top
R6  33.58,24.94 180 top
R7  29.62,27.43 90 top
R8  34.65,32.28 90 top
R9  30.48,33.05 0 top
R10  65.89,52.27 0 top
R11  65.89,49.2 0 top
R12  20.29,83.9 180 top
R13  20.19,86.26 180 top
R14  20.27,95.22 180 top
R15  20.27,99.85 180 top
R16  22.63,76.83 270 top
R17  27.99,96.57 270 top
R18  69.22,49.15 0 top
R19  39.52,28.32 90 top
R20  20.27,96.77 0 top
R21  20.27,98.32 0 top
R22  21.08,75.03 90 top
R23  41.55,119.58 180 top
R24  69.22,50.7 180 top
R25  31.8,75.97 90 top
R26  29.6,75.97 270 top
R27  49.91,32.69 90 top
R28  24.38,129.95 90 top
R29  70.56,38.33 180 top
R30  71.42,36.02 90 top
R31  34.42,123.55 0 top
R32  39.65,124.33 270 top
R33  38.05,124.33 270 top
R34  37.01,31.39 180 top
R35  58.57,33.4 180 top
R36  55.42,30.33 180 top
R37  56.95,28.68 0 top
R39  33.4,120.93 270 top
R40  52.58,89.51 180 top
R41  21.72,107.47 180 top
R42  52.35,31.91 0 top
R43  21.72,105.92 180 top
R44  55.43,31.9 180 top
R45  52.58,91.01 180 top
R46  31.85,108.28 0 top
R47  55.41,33.43 180 top
R48  33.81,106.65 0 top
R49  67.39,36.78 0 top
R50  64.82,37.54 270 top
R51  28.02,101.63 90 top
R52  63.07,37.54 90 top
R53  26.54,101.6 90 top
R54  25.07,101.57 90 top
R55  30.58,106.65 0 top
R56  30.58,105.16 0 top
R57  30.58,103.58 180 top
R58  20.27,101.45 0 top
R59  35.23,130.43 180 top
R60  35.23,128.83 0 top
R61  24.43,118.14 90 top
R62  22.91,118.14 90 top
R63  52.35,33.45 0 top
R64  56.29,37.54 270 top
R65  52.58,70.71 270 top
R66  54.56,70.71 90 top
RST  2.84,75.13 90 top
RW1  76.5,37.54 270 top
SD  17,29.57 180 top
SPK  5.82,108.41 270 top
U1  12.8,51.5 90 top
U2  36.75,120.8 180 top
U3  29.59,90.53 90 top
U4  59.46,37.36 90 top
U5  33.71,110.74 90 top
U6  23.75,124 270 top
U$1  [MAKERFABS_0.3]  26.85,151.47 0 top
USB-NATIVE  6.7,98 270 top
USB-TTL  6.7,85 270 top
VCOM  74.88,42.62 0 top
VGH  68.68,59.21 0 top
VGL  66.67,59.13 90 top
VPWR  32.46,114.12 270 top

### Tracks (layer width: path | path; a pad name or v marks a point on that pad's centre or on a via)
3.3V  (via drill 0.3)
  Top 0.254: C16.2 C60.2 C14.1 C17.2 | R65.2 50.77,69.95 C16.2 | R1.2 C17.2 | C17.2 v50.77,75.5 P3.12 | R45.2 52.91,92.1 53.9,92.1 55,91 P3.43 P3.44 | R45.2 R40.2 51.79,89.54 C21.2 | C20.2 51.79,91.04 R45.2 | C16.2 C32.1 C31.1 50.78,55.93 54.11,52.59 C22.1 54.08,46.49 54.08,36.41 | 54.08,36.41 C5.2 | U4.5 56.31,36.41 | 56.31,36.41 54.08,36.41 | R64.2 56.31,36.78 56.31,36.41
  Top 0.406: P4.1 v53.11,12 49.9,12 47.4,14.5 P1.1 | R44.2 R36.2 54.63,30.3 C29.2 C23.2 v53.11,27.77 v53.11,27.76 | R42.2 54.65,31.91 R44.2 | R44.2 54.66,33.41 R47.2 54.62,33.45 54.05,33.45 | R63.2 54.05,33.45 | C5.2 54.08,33.48 54.05,33.45 | L2.P$1 C24.2 | 54.08,36.41 54.08,37.06 C25.2 | C62.2 C63.2 C24.2 | C24.2 C30.2 C22.1 54.11,48.75 3V3.T
  Bottom 1.016: v50.77,75.5 v50.77,89.5 | v53.11,12 v53.11,27.76
  pour Top: 28.22,14.76 47.6,14.76 50.01,12.34 67.74,12.34 67.74,11.43 49.68,11.43 47.35,13.77 28.22,13.77
  pour Top: 52.65,27.53 52.65,33.78 53.54,34.67 53.54,51.87 50.22,55.19 50.22,75.31 50.67,75.77 50.77,75.87 56.36,75.87 56.59,75.64 58.6,75.64 58.6,75.41 53.26,75.41 52.88,75.03 52.88,73.99 51.79,73.99 51.49,73.69 51.49,70.84 51.79,70.54 52.86,70.54 52.86,69.44 51.92,69.44 51.49,69.01 51.49,56.36 54.74,53.11 54.74,46.35 56.03,45.06 57.38,45.06 57.38,40.08 55.8,40.08 55.19,39.47 55.19,37.59 55.52,37.26 58.62,37.26 58.62,35.97 55.63,35.97 55.12,35.46 55.12,27.64 55.12,27.53
  pour Top: 49.35,89 52.2,89 52.2,91.29 52.78,91.87 53.98,91.87 54.89,90.96 58.65,90.96 58.65,91.54 55.58,91.54 54.66,92.46 54.48,92.63 50.04,92.63 49.35,91.95
5V  (via drill 0.3)  (3 unrouted)
  Top 0.254: USB-NATIVE.VBUS2 7.41,95.55 | 25.65,119.25 U6.8 | CHRG.A 24.66,113.58 DONE.A 21.01,113.58 18.3,113.58 v17.91,113.59 | v17.91,94.89 17.65,94.89 16.99,95.55
  Top 0.406: 20.83,113.33 20.83,113.31 20.68,113.31 20.68,113.28 C37.1 21.01,113.28 21.01,113.58
  Top 0.61: USB-NATIVE.VBUS1 v17.91,100.45 18.51,100.45 R58.1 | USB-NATIVE.VBUS2 16.99,95.55 17.25,95.55 v17.91,94.89 19.13,93.67 C38.1 C39.1 21.67,93.67 23.39,91.95 23.39,91.42 | U6.4 v21.84,128.19 C36.2 | v26.44,122.56 26.44,120.78 26.16,120.78 | 26.16,120.78 25.81,120.78 25.81,120.83 25.65,120.83 U6.8 | D2.A 26.16,120.07 26.16,120.78
  Bottom 0.61: v21.84,128.19 24.13,128.19 26.42,125.91 v26.44,122.56
  Bottom 0.813: v17.91,94.89 v17.91,100.45 v17.91,113.59
  other vias: 18.08,112.98 17.91,101.01 17.93,95.55
  pour Top: 27.18,112.88 17.25,112.88 17.25,114.17 25.12,114.17 25.63,114.68 25.63,121.44 26.62,121.44 26.62,116.41 27.15,115.87 27.18,115.85
!SD
  Top 0.254: IC2.P$4 29.78,106.62 R55.1
+3V3  (via drill 0.3)  (1 unrouted)
  Top 0.254: U5.5 32.61,109.59 R46.2 v33.48,108.28
  Top 0.305: C18.2 v26.16,92.23 | U5.5 30.77,109.79 C42.1 v30.71,110.54
  Top 0.406: U3.10 27.58,93.22 C18.2 C3.2 | 31.24,28.47 29.52,28.47 29.62,28.36 R7.2 | 31.24,28.47 32.51,28.47 | 32.51,28.47 32.75,28.47 D4.4 | R6.2 R5.2 32.82,28.16 32.51,28.47 | 31.24,28.47 31.27,28.43 C54.2 31.24,28.22 C9.1 C10.1 R9.2 R4.2 R8.2 39.39,33.05 PWR.A 40.06,33.45 R27.2 R63.1 | 33.05,28.19 33.05,24.71 32.59,24.71 32.59,27.89 32.28,28.19 31.42,28.19 31.42,32.61 31.04,32.61 31.04,32.97 31.01,32.97 31.01,29.11 30.53,28.63 30.81,28.63 31.29,29.11 31.45,29.11 32.03,28.52 31.27,28.52 31.27,33.27 39.88,33.27 40.06,33.45 31.09,33.45 30.96,33.33 30.96,32.23 | 30.96,28.98 30.96,32.23 | 30.96,32.23 31.42,32.69 39.47,32.69 39.85,33.07 51.84,33.07
  Top 0.61: U3.7 v30.59,94.51 30.59,95.16 C19.2
  Top 0.813: J2.3 v30.71,144.81 | J1.3 19.41,131.29 20.3,132.18 v30.71,132.18 | v20,75.79 R22.2 22.35,75.79 R16.2 | C54.2 31,28.47 v25.12,28.47 SD.4 12.1,28.47 8.81,31.75 U1.2
  Bottom 0.305: 29.56,95.54 29.48,95.54
  Bottom 0.813: v33.48,108.28 33.48,99.54 29.48,95.54 v26.16,92.23 20,86.06 v20,75.79 20,56.19 25.12,51.06 v25.12,28.47 | v30.59,94.51 29.56,95.54 | v30.71,110.54 v30.71,132.18 v30.71,144.81
  pour Top: 25.7,95.22 25.7,92.18 25.98,91.9 27.36,91.9 27.86,92.41 27.86,94.06 26.75,95.17 26.7,95.22
  pour Top: 33.76,107.8 32.16,107.8 32.16,108.74 31.7,109.19 30.23,109.19 30.23,110.67 32.59,110.67 32.92,110.34 32.92,109.45 33.73,108.64 33.76,108.61
AVDD10  (via drill 0.3)
  Top 0.254: P3.8 64.93,73.5 65.63,72.8 v65.63,63.07
  Top 0.61: 68.15,37.85 R49.2 C53.2 R29.2 C55.2 69.8,41.96 | 68.15,37.85 C61.2 | v68.15,39.29 68.15,37.85 | 69.8,41.96 69.8,43.69 D7.1 | D9.- 69.85,41.91 69.8,41.96
  Bottom 0.254: v65.63,63.07 65.63,44.55 65.63,42.24 65.63,41.81 v68.15,39.29
D+  (via drill 0.3)
  Top 0.254: USB-TTL.A6 7.59,85.25 | 7.59,85.25 26.2,85.25 27.58,86.64 U3.1 | USB-TTL.B6 7.39,84.25 v7.59,84.05 | v7.59,85.37 7.59,85.25
  Bottom 0.254: v7.59,84.05 v7.59,85.37
D-
  Top 0.254: U3.2 28.59,86.4 26.92,84.73 6.38,84.73 USB-TTL.A7 5.45,84.75 5.21,84.99 5.21,85.47 5.49,85.75 USB-TTL.B7
DCLK  (via drill 0.3)  (1 unrouted)
  Top 0.254: FB1.2 C1.2 v23.8,71.7 | P3.14 v56.33,76.5
  Bottom 0.254: v23.8,71.7 51.54,71.7 v56.34,76.5
DTR  (via drill 0.3)
  Top 0.254: 29.54,75.2 R26.2
  Top 0.406: Q3.2 29.59,75.19 R26.2 v30.55,75.21 v30.56,75.21 | U3.4 30.59,86.06 v30.56,86.03
  Bottom 0.406: v30.56,75.21 v30.56,86.03
GAIN
  Top 0.254: IC2.P$2 29.36,105.62 R56.1 R57.2
GND  (via drill 0.3)
  Top 0.254: IC2.P$15 26.03,105.62 IC2.P$EP | 25.53,105.62 IC2.P$EP | IC2.P$3 26.03,106.12 IC2.P$EP | 23.42,105.51 23.52,105.62 IC2.P$11 25.78,105.62 IC2.P$EP | P3.46 58.84,92.5 60.35,94 P3.51 | P3.51 | v55.8,70.66 56.14,71 P3.3 59.96,71 60.35,70.61 P3.52 | 59.79,76 59.79,75.29 59.51,75 P3.11 55.04,75 C15.1 | 59.79,76 59.79,76.91 | 59.79,76.91 59.79,82.07 | 59.79,82.07 59.79,86.03 59.33,86.49 58.01,86.49 P3.34 P3.32 | P3.13 59.79,76 | 59.79,76.91 59.7,77 P3.15 P3.18 59.73,78.5 59.74,78.51 | 59.79,82.07 59.72,82 P3.25 P3.24 | P3.52 | 24.43,93.34 25.12,92.66 25.12,91.08
  Top 0.406: D4.2 33.76,29.24 33.76,29.23
  other vias: 96.47,19.84 98.07,7.49 77.6,102.82 69.24,84.4 40.51,87.76 91.44,91.95 76.12,72.62 93.95,105.92 94.26,35.1 1.73,16.56 90.22,71.3 97.87,77.44 66.6,89.36 87.93,6.38 15.54,5.61 96.29,92.02 52.93,77.62 22.4,35.71 97.61,70.79 96.85,2.72 23.57,46.79 66.04,97.76 42.9,9.53 16.99,10.64 24.66,21.54 12.67,14.22 97.69,12.17 85.78,117.83 44.45,11.25 89.48,41.35 80.85,49.53 2.54,2.9 76.53,85.95 37.34,89.28 23.09,6.32 40.28,89.53 2.67,8.89 85.39,24.46 90.42,82.37 38.99,5.77 42.52,104.8 97.54,83.39 89.87,2.59 89.18,48.31 85.9,34.47 96.06,45.62 96.85,61.47 2.24,22.68 1.83,32.21 6.45,29.67 7.92,22.25 11.48,38.07 12.32,31.88 13.23,36.35 13.97,30.76 12.7,24.46 9.98,24 10.69,21.79 39.47,34.7 8.1,48.82 8,56.11 8.1,52.3 12.14,55.65 13.51,48.34 16.81,48.9 14.99,50.6 13.89,50.11 16.59,49.99 15.42,49.1 17.7,56.87 12.7,51.69 11.94,47.83 12.9,53.37 12.95,45.95 15.6,46.63 23.34,56.16 23.37,64.34 11.76,70.76 7.95,64.06 6.1,68.3 1.35,71.81 6.86,73.58 11.91,75.46 25.6,76.05 24.77,72.85 24.26,67.26 33.02,63.8 30.02,66.45 29.26,62.46 35.18,74.37 40.23,92.13 37.64,84.53 25.91,89.18 24.18,81.81 10.31,79.68 2.84,84.15 3.63,91.52 2.11,86.82 3.23,79.22 9.37,92.2 16.48,93.19 1.7,97.16 1.88,99.52 2.41,108.74 1.32,104.01 10.72,104.44 16.05,103.76 22.4,103.38 25.5,106.07 26.01,105.66 22.53,110.74 16.61,115.49 16.43,110.67 2.06,118.75 1.32,112.85 10.95,112.65 2.77,131.72 2.46,128.37 2.72,142.7 2.9,145.34 2.13,162.48 1.47,155.7 9.32,163.17 10.36,154.08 6.55,153.72 24.49,159.33 38.51,159.49 32.54,154.84 48.31,160.15 67.51,161.54 56.39,161.47 60.45,154.43 77.55,161.54 98.3,163.47 98.37,157.84 89.97,162.84 94.67,148.03 94.18,141.58 94.26,130.15 77.17,151.31 77.85,142.14 71.7,138.79 58.8,142.37 51.71,140.26 46.74,131.57 51.03,123.32 35.61,137.08 25.98,137.39 19.28,136.45 28.04,129.72 29.26,121.49 16.79,123.62 60.88,102.34 89.69,56.57 69.37,104.29 28.37,91.34 29.13,91.34 29.92,91.34 30.66,91.34 30.91,90.75 30.28,90.68 29.64,90.65 28.98,90.65 28.27,90.6 28.55,89.99 29.29,89.84 30.02,89.94 30.81,89.89 29.97,101.09 44.37,98.91 61.21,75.67 65.91,84.91 80.85,58.93 48.23,75.49 53.57,74.73 44.86,28.88 44.12,24.08 27.53,22.53 38.46,23.88 32.77,35.76 50.5,47.45 49.4,39.5 45.06,37.57 56.95,47.73 48.11,64.19 48.95,59.69 53.11,67.92 57.81,63.4 59.36,55.4 61.77,50.6 66.95,46.63 72.11,64.39 72.16,55.58 72.47,46.61 65.58,33.25 71.63,26.75 75.92,6.12 60.88,4.47 50.6,23.42 54.81,22.53 77.93,129.97 67.41,123.29 23.62,95.83 26.37,90.27 48.92,85.8 52.65,85.75 56.46,85.95 56.13,77.9 49.1,77.14 20.19,53.16 23.01,49.73 22.4,124.89 23.11,124.87 23.75,124.87 24.38,124.87 25.04,124.87 25.02,124.21 24.99,123.6 24.99,123.01 24.36,123.04 23.72,123.04 23.06,123.06 22.43,123.06 22.45,123.62 22.48,124.23 23.24,124.23 23.32,123.62 24.03,124.18 24.28,123.65 27.76,124.46
  pour Top (isolate 0.305, rank 6): -7,180 -7,-20 150,-20 150,180
  pour Bottom (isolate 0.305, rank 6): -6,-20 150,-20 150,180 -6,180
I2S_BCLK
  Top 0.254: IC2.P$16 26.53,102.37 R53.2
I2S_DIN
  Top 0.254: IC2.P$1 27.18,103.22 R51.2
I2S_LRCLK
  Top 0.254: IC2.P$14 25.53,102.8 R54.2
IO0  (1 unrouted)
  Top 0.406: U1.27 26.21,62.41 26.21,73.86 25.86,74.22 25.86,74.24 | BOOT.2 7.31,70.03 11.58,74.3 21.06,74.3 R22.1 25.82,74.27 Q3.3
IO1  (via drill 0.3)
  Top 0.254: P3.39 60.99,89 61.38,88.6 v63.45,88.6
  Top 0.406: U1.39 8.81,59.34 10.08,58.06 22.94,58.06 v23.68,58.8
  Bottom 0.406: v23.68,58.8 46.25,58.8 63.45,76 v63.45,88.6
IO2  (via drill 0.3)
  Top 0.254: 25.09,100.79 R54.1
  Top 0.305: v25.09,99.87 25.09,100.79 | U1.38 10.08,65.4 v16.69,72.01
  Bottom 0.305: v16.69,72.01 16.69,87.5 25.09,95.91 v25.09,99.87
IO3
  Top 0.254: U1.15 25.31,44.5 39.52,44.5 42.8,47.78 42.8,81.53 42.8,81.66 42.8,82.73 47.57,87.5 P3.36
IO4  (via drill 0.3)
  Top 0.254: U1.4 11.35,41.97 15.14,38.18 39.42,38.18 46.89,45.64 46.89,81.05 47.74,81.9 v53.75,81.9 | P3.31 53.95,85 v53.75,85.2
  Bottom 0.254: v53.75,81.9 v53.75,85.2
IO5
  Top 0.254: U1.5 12.62,41.79 15.65,38.76 39.19,38.76 46.3,45.87 46.3,81.28 47.52,82.5 P3.26
IO6
  Top 0.254: U1.6 13.89,41.56 16.13,39.32 38.81,39.32 45.72,46.23 45.72,81.51 47.21,83 P3.27
IO7
  Top 0.254: U1.7 15.16,41.35 16.64,39.88 38.58,39.88 45.19,46.48 45.19,81.81 46.87,83.5 P3.28
IO8
  Top 0.254: U1.12 21.51,42.07 22.05,41.53 37.64,41.53 43.41,47.3 43.41,82.53 47.88,87 P3.35
IO9
  Top 0.254: U1.17 25.31,47.07 40.21,47.07 41.53,48.39 41.53,83.06 46.97,88.5 P3.38
IO10  (via drill 0.3)
  Top 0.406: v24.11,48.31 24.12,48.33 U1.18 37.76,48.33 v37.77,48.34 | v32.49,130.43 R59.2 | R34.1 v37.77,30.45
  Bottom 0.406: v24.11,48.31 24.11,50.67 19,55.78 19,86.56 32.49,100.05 v32.49,130.43 | v37.77,30.45 v37.77,48.34
IO11/MOSI  (via drill 0.3)
  Top 0.406: R4.1 33.01,31.4 v33.01,30.63 D4.3 | U1.19 27.04,49.59 v27.05,49.58 | SD.3 27.5,27.37 v27.54,27.33
  Bottom 0.406: v33.01,30.63 34.59,29.05 34.59,27.36 34.21,26.98 27.89,26.98 v27.53,27.33 | v27.05,49.58 27.05,27.81 27.5,27.37 v27.53,27.33 | v27.54,27.33 v27.53,27.33
IO12/SCLK  (via drill 0.3)
  Top 0.406: D4.5 v33.76,27.66 33.76,27.07 R5.1 | SD.5 27.33,29.57 v27.8,29.57 | U1.20 27.79,50.87 v27.8,50.88
  Bottom 0.406: 33.78,27.68 v33.76,27.66 28.98,27.66 27.8,28.84 v27.8,29.57 v27.8,50.88
IO13/MISO  (via drill 0.3)  (1 unrouted)
  Top 0.406: D4.6 34.79,28.2 35.53,27.46 35.53,25.38 35.1,24.94 R6.1 | SD.7 26.28,31.77 v26.29,31.77 | U1.21 27.22,52.13 v27.23,52.15
  Bottom 0.406: v27.23,52.15 26.29,51.2 v26.29,31.77 26.29,26.44 27.56,25.17 v35.33,25.17
IO14  (via drill 0.3)
  Top 0.254: U1.22 38.6,53.41 40.82,55.63 v40.82,81 | P3.23 v47.8,81
  Bottom 0.254: v47.8,81 v40.82,81
IO15
  Top 0.254: U1.8 16.43,41.43 17.45,40.41 38.3,40.41 44.6,46.71 44.6,82.07 46.53,84 P3.29
IO16
  Top 0.254: U1.9 17.7,42.09 18.82,40.97 37.97,40.97 44.02,47.02 44.02,82.35 46.17,84.5 P3.30
IO17/I2C_SDA  (via drill 0.3)
  Top 0.406: J2.2 v13.54,142.81 | U1.10 18.97,44.34 v18.97,44.7 | P4.5 v56.99,16 52.02,16 49.52,18.5 P1.5 19.57,18.5 v19.2,18.87 | v56.16,34.42 56.16,33.44 R47.1
  Bottom 0.406: v13.54,142.81 13.54,54.71 18.97,49.28 v18.97,44.7 18.97,19.1 v19.2,18.87 | v56.99,16 56.99,33.59 v56.16,34.42
IO18/I2C_SCL  (via drill 0.3)  (1 unrouted)
  Top 0.254: v20.24,44.95 v20.24,44.96
  Top 0.406: J2.1 v14.43,140.81 | U1.11 v20.24,44.95 | P4.4 51.37,15 48.87,17.5 P1.4 v20.57,17.5 | R42.1 51.57,31.93 R27.1 v48.72,31.93
  Bottom 0.406: v14.43,140.81 14.43,56.67 14.43,56.11 14.43,55.07 20.24,49.25 v20.24,44.96 20.24,17.83 v20.57,17.5 | v48.72,17.5 v48.72,31.93
IO19  (via drill 0.3)
  Top 0.254: v18.96,127.29 v18.97,127.31
  Top 0.305: R51.1 28.02,99.21 25.58,96.77 v21.97,96.77 R20.2
  Top 0.406: J1.1 v18.96,127.29 | U1.13 22.78,44.35 v21.16,45.97
  Bottom 0.305: 18.97,100.79 18.97,101.96
  Bottom 0.406: v18.97,127.31 18.97,101.96 | 18.97,100.79 21.97,97.79 v21.97,96.77 21.97,95.15 15.21,88.39 15.21,56.9 15.21,56.52 15.21,55.52 21.16,49.58 v21.16,45.97
IO20  (via drill 0.3)
  Top 0.254: v19.7,129.29 v19.71,129.29
  Top 0.305: R53.1 26.54,99.16 25.7,98.32 v22.66,98.32 R21.2
  Top 0.406: J1.2 v19.7,129.29 | U1.14 23.8,43 23.8,44.55 21.97,46.38 v21.97,47.04
  Bottom 0.254: 19.71,105.87 19.71,102.31
  Bottom 0.305: 19.71,101.27 19.71,105.87
  Bottom 0.406: v19.71,129.29 19.71,105.87 | 19.71,101.27 v22.66,98.32 22.66,94.56 15.98,87.88 15.98,57.12 15.98,56.82 15.98,55.96 21.97,49.96 v21.97,47.04
IO21  (via drill 0.3)
  Top 0.254: U1.23 38.49,54.67 40.13,56.31 v40.13,80.4 | P3.22 48.3,80.5 v48.2,80.4
  Bottom 0.254: v40.13,80.4 v48.2,80.4
IO38  (via drill 0.3)
  Top 0.406: U1.31 18.97,59.19 19.33,58.83 v22.61,58.83 | v59.33,34.39 R35.1
  Bottom 0.406: v22.61,58.83 23.44,57.99 49.58,57.99 59.33,48.23 v59.33,34.39
IO39  (via drill 0.3)
  Top 0.254: R40.1 P3.40 v61.7,89.5
  Top 0.305: U1.32 17.7,66.39 20.52,69.22 v22,69.22
  Bottom 0.254: v22,69.22 52.22,69.22 61.7,78.69 v61.7,89.5
IO40  (via drill 0.3)
  Top 0.254: P3.42 59.46,90.5 59.79,90.83 v60.94,90.83
  Top 0.305: U1.33 16.43,66.24 20.12,69.93 v22.5,69.93
  Bottom 0.254: v22.5,69.93 51.84,69.93 60.94,79.02 v60.94,90.83
IO41  (via drill 0.3)
  Top 0.254: R45.1 54.35,90 P3.41 60.12,90 v60.27,90.15
  Top 0.305: U1.34 15.16,66.09 19.74,70.66 v22,70.66
  Bottom 0.254: v22,70.66 51.51,70.66 60.27,79.43 v60.27,90.15
IO42
  Top 0.305: U1.35 13.89,66 FB1.1
IO45  (via drill 0.3)
  Top 0.254: U1.26 36.9,58.48 37.97,59.56 v37.97,78.5 | P3.19 49.66,79 49.16,78.5 v47.7,78.5
  Bottom 0.254: v37.97,78.5 v47.7,78.5
IO46
  Top 0.254: U1.16 39.82,45.78 42.14,48.11 42.14,82.83 47.31,88 P3.37
IO47  (via drill 0.3)
  Top 0.254: U1.24 38.49,55.95 39.37,56.82 v39.37,79.7 | P3.21 48.78,80 48.48,79.7 v47.7,79.7
  Bottom 0.254: v39.37,79.7 v47.7,79.7
IO48  (via drill 0.3)
  Top 0.254: U1.25 37.84,57.22 38.66,58.04 v38.66,79.1 | P3.20 49.3,79.5 48.9,79.1 v48.2,79.1
  Bottom 0.254: v38.66,79.1 v48.2,79.1
LCD_RST
  Top 0.254: P3.7 C15.2 R1.1
LED+  (via drill 0.3)  (1 unrouted)
  Top 0.254: P3.49 P3.50
  Top 0.61: U2.5 v34.52,120.8
  Top 0.8: v55.24,94.25 58.26,94.25
  Top 0.813: D1.- 40.81,115.65 C12.2 42.44,115.67 C11.2 v46.61,115.67
  Bottom 0.813: v55.24,94.25 55.24,107.04 v46.61,115.67 41.48,120.8 v34.52,120.8
LED-  (via drill 0.3)
  Top 0.254: P3.47 58.26,93.25 P3.48
  Top 0.61: U2.3 R33.2 R32.2
  Top 0.8: v56.67,93.25 58.26,93.25
  Top 0.813: v40.74,123.57 R32.2
  Bottom 0.813: v56.67,93.25 56.67,107.64 v40.74,123.57
N$1
  Top 0.61: D6.1 C47.2 R11.1
N$2
  Top 0.406: Q4.1 29.59,76.75 R26.1
N$3
  Top 0.406: Q3.1 30.67,73.29 31.8,74.42 31.8,75.38 R25.1
N$4
  Top 0.61: R52.1 R50.2 R49.1 C61.1
N$5
  Top 0.254: P3.4 54.58,71.5 R66.2 R65.1
N$6
  Top 0.254: USB-NATIVE.A5 18.91,99.25 R15.2
N$7
  Top 0.406: PWR.C R19.2
N$8
  Top 0.61: C48.2 D6.3
N$9
  Top 0.61: U4.1 59.75,36.41 59.46,36.7 59.46,41.02 | 59.46,41.02 59.46,41.81 L2.P$2 | 59.46,41.02 59.51,41.07 C48.1 C49.2 66.75,41.07 D9.+
N$10
  Top 0.254: USB-TTL.A5 R13.2
N$11
  Top 0.254: USB-TTL.B5 18.89,83.25 R12.2
N$12
  Top 0.61: C49.1 65.86,42.81 D7.3
N$13
  Top 0.61: R18.2 C50.2 D7.2
N$14
  Top 0.254: USB-NATIVE.B5 18.48,96.25 R14.2
N$15
  Top 0.61: U4.3 63.06,38.31 R52.2
N$16
  Top 0.61: R30.2 R3.1 74.64,36.78 RW1.2 77.13,36.54 RW1.3
N$17
  Top 0.254: L1.P$2 38.05,116.2 38.05,119.33 | 38.05,119.33 U2.1 | 38.05,119.33 40.54,119.33 R23.2 D1.+
  pour Top: 37.36,120.04 37.36,113.56 39.42,113.56 39.42,116.87 39.93,117.37 41.22,117.37 41.22,119.99 41.22,120.04
N$19
  Top 0.61: U4.4 56.29,38.31 R64.1
N$21
  Top 0.254: IC2.P$9 23.33,106.62 R41.1
N$22
  Top 0.61: R23.1 C2.2
N$23
  Top 0.254: IC2.P$10 22.68,106.12 R43.1
N$24
  Top 0.61: R39.1 33.61,121.75 U2.4 35.18,122.03 R31.2 Q7.3
N$26
  Top 0.406: SPK.1 14.41,109.03 15.98,107.47 C33.2 R41.2
N$27
  Top 0.406: SPK.2 13.83,107.78 15.7,105.92 C34.2 R43.2
N$29
  Top 0.61: Q7.1 35.99,127.26 R60.2 R59.1
N$30
  Top 0.61: U6.2 R28.1
N$31
  Top 0.61: U6.7 24.38,118.95 R61.2
N$32
  Top 0.61: U6.6 23.11,119.1 R62.2
N$33
  Top 0.61: R61.1 24.43,115.91 CHRG.C
N$34
  Top 0.61: R62.1 22.91,115.81 DONE.C
N$46
  Top 0.406: U3.9 28.59,95.21 R17.2
N$47
  Top 0.406: SD.1 28.11,25.17 R7.1
N$48
  Top 0.406: SD.8 29.54,32.87 R9.1
N$49
  Top 0.406: U3.8 29.59,95.78 R2.2
N$76
  Top 0.305: U5.4 30.72,111.69 C45.1
RESET  (via drill 0.3)
  Top 0.406: U1.3 10.08,43.79 v10.08,43.94 | RST.2 v10.08,76.81 18.16,76.81 18.95,77.6 R16.1 C8.1 25.83,77.6 Q4.3
  Bottom 0.406: v10.08,43.94 v10.08,76.81
RTS  (via drill 0.6)
  Top 0.406: Q4.2 31.24,78.64 31.8,78.08 31.8,76.91 R25.2 31.8,76.91 v32.94,76.91 | U3.6 v32.94,93.23 v32.94,93.22
  Bottom 0.406: v32.94,93.22 v32.94,76.91
RXD/IO44  (via drill 0.3)
  Top 0.305: U1.36 12.62,65.83 v18.24,71.45 | R2.1 v29.62,98.27
  Bottom 0.305: v18.24,71.45 18.24,86.89 v29.62,98.27
SD_CS  (via drill 0.3)
  Top 0.406: SD.2 v27.81,26.27 v27.81,26.26 | R34.2 v35.46,31.39 35.03,31.39 34.57,30.94 34.51,30.94 | D4.1 34.51,30.94 | 34.51,30.94 34.51,31.39 R8.1
  Bottom 0.406: v27.81,26.26 34.67,26.26 35.46,27.05 v35.46,31.39
TP_INT  (via drill 0.3)
  Top 0.406: P4.2 v56.19,13 50.42,13 47.92,15.5 P1.2 | R36.1 R37.1 v56.19,27.74
  Bottom 0.406: v56.19,27.74 v56.19,13
TP_RST  (via drill 0.3)
  Top 0.406: 58.34,14 P4.3 | R44.1 57.79,31.9 | 57.79,31.9 C13.2 | 57.79,31.9 v57.79,31.14 v57.78,31.14 | v57.78,13.99 58.34,13.99 58.34,14 | 57.79,31.9 57.79,33.38 R35.2 | 58.34,14 50.9,14 48.4,16.5 P1.3
  Bottom 0.406: v57.78,31.14 v57.78,13.99
TXD/IO43  (via drill 0.3)
  Top 0.305: U1.37 11.35,65.63 v17.5,71.78 | R17.1 27.61,97.33 v27.23,96.95
  Bottom 0.305: v17.5,71.78 17.5,87.22 v27.23,96.95
USB_D+  (via drill 0.3)
  Top 0.254: R21.1 19.43,98.25 USB-NATIVE.A6 v4.8,98.25 | USB-NATIVE.B6 5.58,97.25 5.18,96.85 v4.8,96.85
  Bottom 0.254: v4.8,98.25 v4.8,96.85
USB_D-
  Top 0.254: R20.1 18.53,97.75 USB-NATIVE.A7 5.29,97.75 5.05,97.51 4.39,97.51 4.19,97.71 4.19,98.73 4.34,98.88 5.38,98.88 5.51,98.75 USB-NATIVE.B7
VBAT  (via drill 0.3)
  Top 0.254: Q6.3 v28.67,117.28 v28.68,117.27
  Top 0.305: C44.1 19.63,119.34 19.68,119.39 | C40.1 21.29,118.95 20.59,119.65
  Top 0.406: BAT.+ 19.68,119.39 20.33,119.39 20.59,119.65
  Top 0.813: Q6.3 30.33,117.28 D11.+
  Bottom 0.813: v21.7,119.8 24.23,117.27 v28.68,117.27
  pour Top: 7.11,118.41 22.05,118.41 22.05,121.46 20.73,121.46 19.23,119.96 7.11,119.96
VBUS  (via drill 0.3)
  Top 0.254: v8.76,87.45
  Top 0.61: USB-TTL.VBUS2 v8.76,82.55 19.3,82.55 C7.2 | USB-TTL.VBUS1 v8.76,87.45 | v8.76,87.45 19.07,87.45 C4.2 C6.2 22.94,87.83 D10.A
  Bottom 0.61: v8.76,87.45 v8.76,82.55
VCOM  (via drill 0.3)
  Top 0.254: VCOM.T 74.88,70.97 v74.88,71.98 74.88,87.76 70.64,92 P3.45 | P3.5 64.68,72 v64.69,71.98
  Top 0.61: R29.1 73,38.33 R3.2 74.64,38.3 RW1.1 C52.2 VCOM.T
  Bottom 0.254: v64.69,71.98 v74.88,71.98
VDD
  Top 0.254: IC2.P$8 IC2.P$7 25.53,109.11 25.48,109.17 | C28.2 25.48,109.17 | 25.48,109.17 C27.2 C26.2 28.4,108.28 R46.1 31.09,106.91 R55.2 | R55.2 R56.2 | R55.2 R48.1
  pour Top: 33.5,107.24 31.88,107.24 31.65,107.47 31.65,108.51 31.47,108.69 28.73,108.69 27.86,109.55 24.05,109.55 24.05,108.81 24.87,108 24.87,106.98 25.6,106.98 25.6,108.2 25.91,108.51 27.64,108.51 28.32,107.82 30.28,107.82 30.73,107.37 30.73,104.6 32.03,104.6 33.48,106.05 33.5,106.07
VGH
  Top 0.254: P3.10 65.56,74.5 68.68,71.37 VGH.T
  Top 0.61: R18.1 R24.2 C51.2 68.45,53.98 | 68.45,53.98 C56.2 C57.2 68.45,58.98 VGH.T | D8.C 68.47,53.96 68.45,53.98
VGL
  Top 0.254: P3.9 65.24,74 66.67,72.57 VGL.T
  Top 0.61: R11.2 C46.2 R10.2 66.65,53.92 | 66.65,53.92 66.65,55.52 C58.2 C59.2 66.7,59.11 VGL.T | D5.A 66.65,53.92
VPWR
  Top 0.254: R48.2 34.57,107.67 C35.2 35.13,109.67 U5.1 33.95,109.79 33.71,110.03 33.71,111.66 | 33.71,111.66 33.71,114.4 | U5.3 33.74,111.69 33.71,111.66 | Q6.2 29.26,115.18 | 29.26,115.18 30.63,115.18 D11.- | 29.04,114.96 29.26,115.18 | U2.6 34.92,119.85 | 34.92,119.85 33.87,119.85 | L1.P$1 34.83,118.52 34.83,119.75 34.92,119.85
  Top 0.406: C41.1 30.84,113.61 30.84,115.39 32.51,115.39 32.51,115.55 32.41,115.55 32.41,115.65
  Top 0.813: D2.C 33.4,120.07 | 33.4,120.07 R39.2 | 33.4,120.07 33.4,119.94 34.83,118.52
  Top 1.016: D2.C 31.39,120.14 31.32,120.14 31.32,122.94 D3.C 29.79,122.94 C43.2
  pour Top: 34.29,105.87 34.29,108.86 33.43,109.73 33.43,112.24 32.77,112.9 30.23,112.9 30.23,115.98 33.15,115.98 33.48,116.31 33.48,120.17 36.04,120.17 36.04,111.46 34.19,111.46 34.01,111.28 34.01,110.29 34.19,110.11 35.69,110.11 35.69,105.87
  pour Top: 28.09,115.98 30.4,115.98 31.37,115.98 31.37,114.2 30.23,114.2 29.95,114.48 28.09,114.48

### Text on the board
tPlace: GND | MaTouch ESP32-S3 Parallel TFT | +3V3 | IO17/SDA | with Touch 7.0" V1.2 | IO18/SCL | www.makerfabs.com | GND | C36 | +3V3 | 1024X600 | IO20/D+ | IO19/D- | 800X480 | + | CHRG | - | C41 | + | -
tNames: U4